# EAGLE design ClockCubed_v1 (EAGLE 6.5.0)
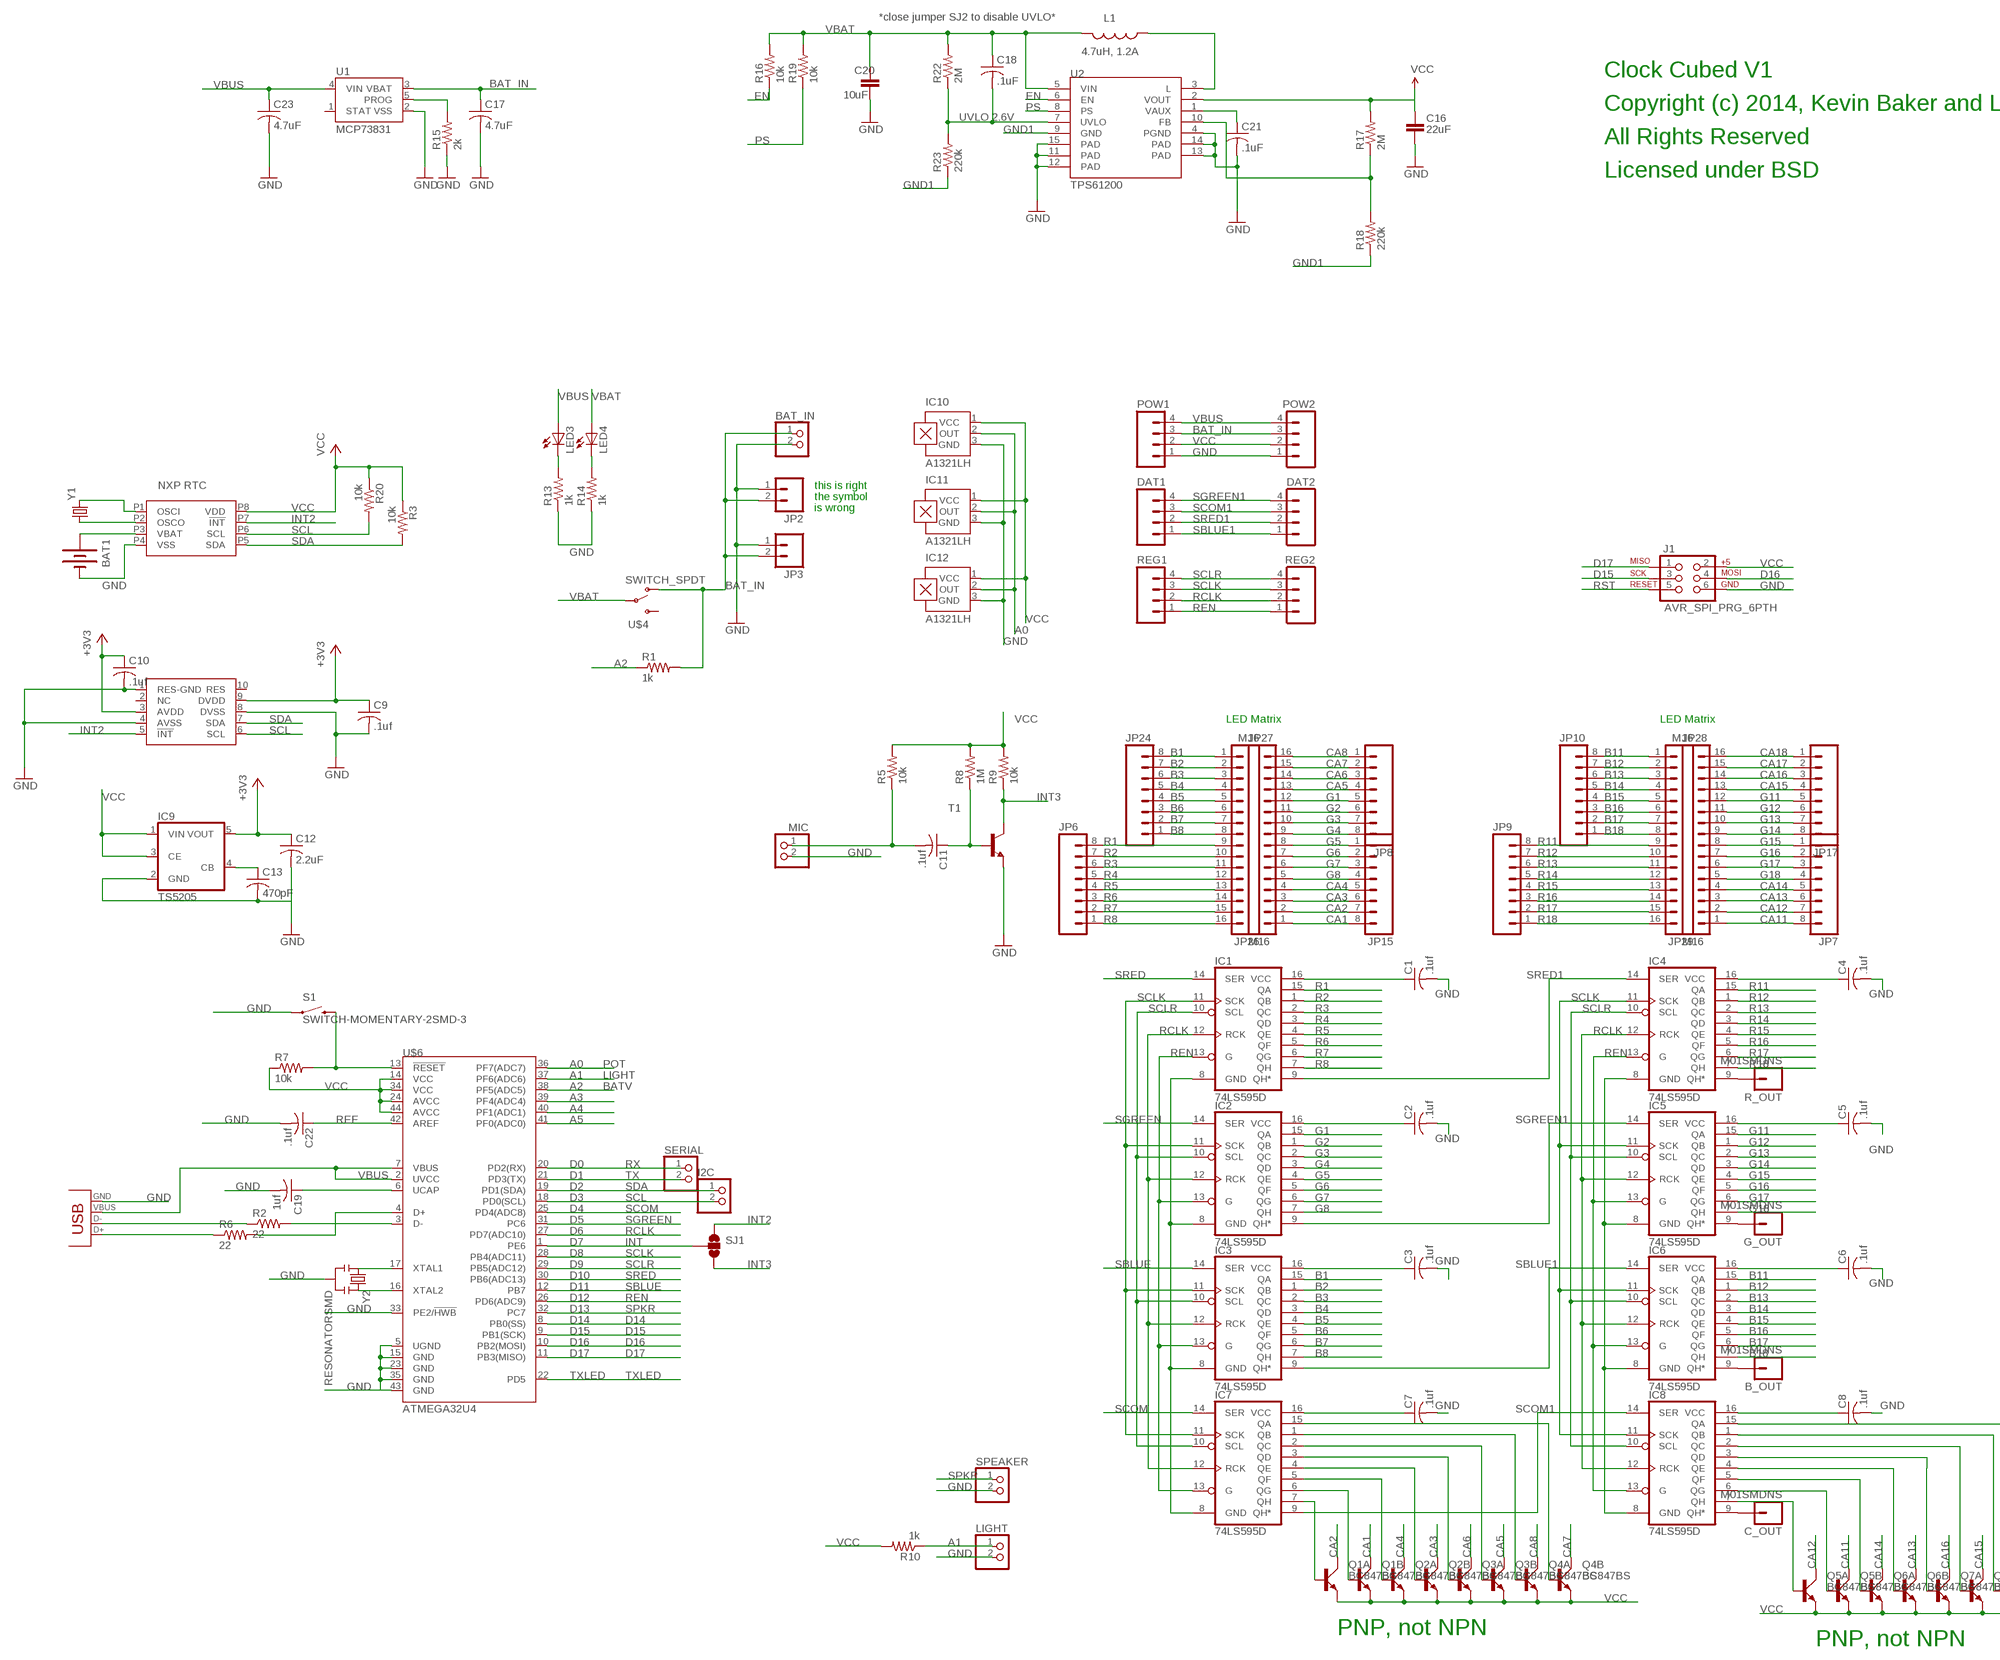
[diagram p0: schematic, sheet 1, part 1 of 2]
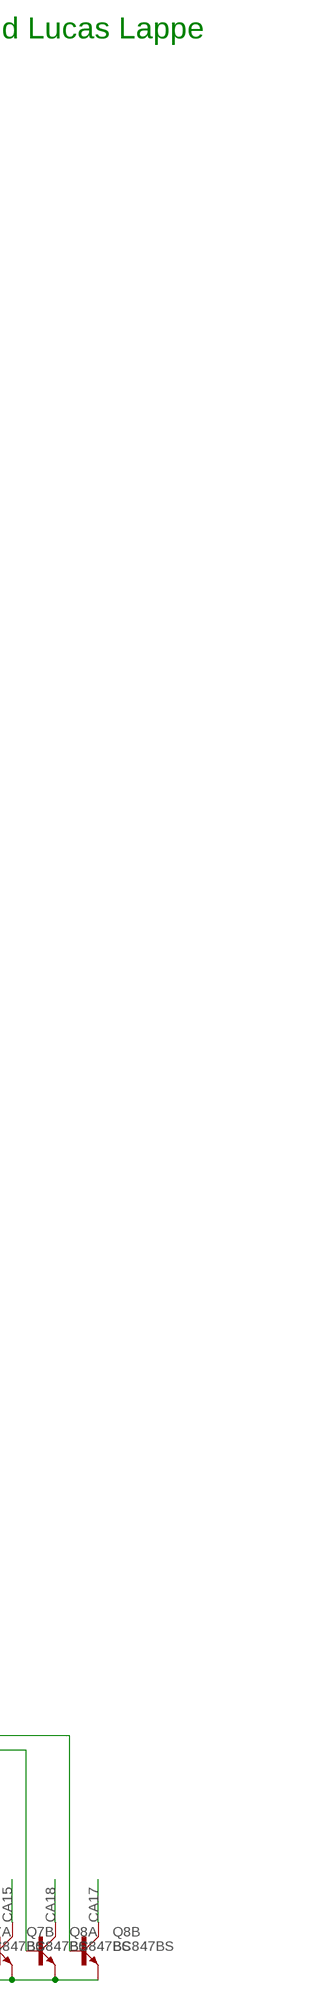
[diagram p1: schematic, sheet 1, part 2 of 2]

## Parts
B_OUT  M01SMDNS  [1X01NS]
BAT1  BATTERY12MM  [BATTCON_12MM]
BAT_IN  PINHD-1X2  [1X02]
C1  .1uf  C-USC0603  [C0603]
C2  .1uf  C-USC0603  [C0603]
C3  .1uf  C-USC0603  [C0603]
C4  .1uf  C-USC0603  [C0603]
C5  .1uf  C-USC0603  [C0603]
C6  .1uf  C-USC0603  [C0603]
C7  .1uf  C-USC0603  [C0603]
C8  .1uf  C-USC0603  [C0603]
C9  .1uf  C-USC0603  [C0603]
C10  .1uf  C-USC0603  [C0603]
C11  .1uf  C-USC0603  [C0603]
C12  2.2uF  C-USC0603  [C0603]
C13  470pF  C-USC0603  [C0603]
C16  22uF  CAP0805  [0805]
C17  4.7uF  C-USC0603  [C0603]
C18  .1uF  C-USC0603  [C0603]
C19  1uf  C-USC0603  [C0603]
C20  10uF  CAP1206  [1206]
C21  .1uF  C-USC0603  [C0603]
C22  .1uf  C-USC0603  [C0603]
C23  4.7uF  C-USC0603  [C0603]
C_OUT  M01SMDNS  [1X01NS]
DAT1  M04PTH  [1X04]
DAT2  M04PTH  [1X04]
G_OUT  M01SMDNS  [1X01NS]
I2C  PINHD-1X2  [1X02]
IC1  74LS595D  [SO16]
IC2  74LS595D  [SO16]
IC3  74LS595D  [SO16]
IC4  74LS595D  [SO16]
IC5  74LS595D  [SO16]
IC6  74LS595D  [SO16]
IC7  74LS595D  [SO16]
IC8  74LS595D  [SO16]
IC9  TS5205  [SOT25]
IC10  A1321LH  [SOT23-W]
IC11  A1321LH  [SOT23-W]
IC12  A1321LH  [SOT23-W]
J1  AVR_SPI_PRG_6PTH  [2X3]
JP2  M02JST-PTH-2  [JST-2-PTH]
JP3  M02JST-PTH-2  [JST-2-PTH]
JP6  M08SMD-COMBO  [1X08_SMD_COMBINED]
JP7  M08SMD-COMBO  [1X08_SMD_COMBINED]
JP8  M08SMD-COMBO  [1X08_SMD_COMBINED]
JP9  M08SMD-COMBO  [1X08_SMD_COMBINED]
JP10  M08SMD-COMBO  [1X08_SMD_COMBINED]
JP15  M08SMD-COMBO  [1X08_SMD_COMBINED]
JP17  M08SMD-COMBO  [1X08_SMD_COMBINED]
JP24  M08SMD-COMBO  [1X08_SMD_COMBINED]
JP26  M16  [1X16_NS]
JP27  M16  [1X16_NS]
JP28  M16  [1X16_NS]
JP29  M16  [1X16_NS]
L1  4.7uH, 1.2A  INDUCTOR.  [CDRH2D09]
LED3  LEDCHIPLED_0805  [CHIPLED_0805]
LED4  LEDCHIPLED_0805  [CHIPLED_0805]
LIGHT  PINHD-1X2  [1X02]
MIC  PINHD-1X2  [1X02]
POW1  M04PTH  [1X04]
POW2  M04PTH  [1X04]
Q1  BC847BS  [SOT363_PHILIPS]
Q2  BC847BS  [SOT363_PHILIPS]
Q3  BC847BS  [SOT363_PHILIPS]
Q4  BC847BS  [SOT363_PHILIPS]
Q5  BC847BS  [SOT363_PHILIPS]
Q6  BC847BS  [SOT363_PHILIPS]
Q7  BC847BS  [SOT363_PHILIPS]
Q8  BC847BS  [SOT363_PHILIPS]
R1  1k  RESISTOR0603-RES  [0603-RES]
R2  22  RESISTOR0603-RES  [0603-RES]
R3  10k  RESISTOR0603-RES  [0603-RES]
R5  10k  RESISTOR0603-RES  [0603-RES]
R6  22  RESISTOR0603-RES  [0603-RES]
R7  10k  RESISTOR0603-RES  [0603-RES]
R8  1M  RESISTOR0603-RES  [0603-RES]
R9  10k  RESISTOR0603-RES  [0603-RES]
R10  1k  RESISTOR0603-RES  [0603-RES]
R13  1k  RESISTOR0603-RES  [0603-RES]
R14  1k  RESISTOR0603-RES  [0603-RES]
R15  2k  RESISTOR0603-RES  [0603-RES]
R16  10k  RESISTOR0603-RES  [0603-RES]
R17  2M  RESISTOR0603-RES  [0603-RES]
R18  220k  RESISTOR0603-RES  [0603-RES]
R19  10k  RESISTOR0603-RES  [0603-RES]
R20  10k  RESISTOR0603-RES  [0603-RES]
R22  2M  RESISTOR0603-RES  [0603-RES]
R23  220k  RESISTOR0603-RES  [0603-RES]
R_OUT  M01SMDNS  [1X01NS]
REG1  M04PTH  [1X04]
REG2  M04PTH  [1X04]
S1  SWITCH-MOMENTARY-2SMD-3  [TACTILE_SWITCH_SMD-3]
SERIAL  PINHD-1X2  [1X02]
SJ1  SOLDERJUMPER_2WAYS  [SJ_3]
SPEAKER  PINHD-1X2  [1X02]
T1  -NPN-SOT23-EBC  [SOT23-EBC]
U1  MCP73831  [SOT23-5]
U2  TPS61200  [QFN-10_PAD]
U$1  USB_MICROB  [USB-MICROB]
U$2  MMA7660FC  [DFN-10]
U$3  NXP-RTC  [HVSON8]
U$4  SWITCH_SPDT  [KPS-1290]
U$6  ATMEGA32U4  [TQFP44]
Y1  CRYSTAL5X2  [CRYSTAL-SMD-5X2]
Y2  RESONATORSMD  [RESONATOR-SMD]

## Nets
+3V3: C9.1 C10.1 C12.1 IC9.5(VOUT) U$2.3(AVDD) U$2.9(DVDD)
A0: IC10.2(OUT) IC11.2(OUT) IC12.2(OUT) U$6.36(PF7(ADC7))
A1: LIGHT.1 R10.1 U$6.37(PF6(ADC6))
A2: R1.1 U$6.38(PF5(ADC5))
A3: U$6.39(PF4(ADC4))
A4: U$6.40(PF1(ADC1))
A5: U$6.41(PF0(ADC0))
B1: IC3.15(QA) JP24.8 JP26.1
B2: IC3.1(QB) JP24.7 JP26.2
B3: IC3.2(QC) JP24.6 JP26.3
B4: IC3.3(QD) JP24.5 JP26.4
B5: IC3.4(QE) JP24.4 JP26.5
B6: IC3.5(QF) JP24.3 JP26.6
B7: IC3.6(QG) JP24.2 JP26.7
B8: IC3.7(QH) JP24.1 JP26.8
B11: IC6.15(QA) JP10.8 JP29.1
B12: IC6.1(QB) JP10.7 JP29.2
B13: IC6.2(QC) JP10.6 JP29.3
B14: IC6.3(QD) JP10.5 JP29.4
B15: IC6.4(QE) JP10.4 JP29.5
B16: IC6.5(QF) JP10.3 JP29.6
B17: IC6.6(QG) JP10.2 JP29.7
B18: IC6.7(QH) JP10.1 JP29.8
BAT_IN: BAT_IN.1 C17.1 JP2.2 JP3.2 POW1.3 POW2.3 R1.2 U1.3(VBAT) U$4.O
CA1: JP15.8 JP27.1 Q1.3(B:C)
CA2: JP15.7 JP27.2 Q1.6(A:C)
CA3: JP15.6 JP27.3 Q2.3(B:C)
CA4: JP15.5 JP27.4 Q2.6(A:C)
CA5: JP8.4 JP27.13 Q3.3(B:C)
CA6: JP8.3 JP27.14 Q3.6(A:C)
CA7: JP8.2 JP27.15 Q4.3(B:C)
CA8: JP8.1 JP27.16 Q4.6(A:C)
CA11: JP7.8 JP28.1 Q5.3(B:C)
CA12: JP7.7 JP28.2 Q5.6(A:C)
CA13: JP7.6 JP28.3 Q6.3(B:C)
CA14: JP7.5 JP28.4 Q6.6(A:C)
CA15: JP17.4 JP28.13 Q7.3(B:C)
CA16: JP17.3 JP28.14 Q7.6(A:C)
CA17: JP17.2 JP28.15 Q8.3(B:C)
CA18: JP17.1 JP28.16 Q8.6(A:C)
D14: U$6.8(PB0(SS))
D15: J1.3 U$6.9(PB1(SCK))
D16: J1.4 U$6.10(PB2(MOSI))
D17: J1.1 U$6.11(PB3(MISO))
D+: R6.1 U$1.P3
D-: R2.1 U$1.P2
EN: R16.1 U2.6(EN)
FB: R17.1 R18.2 U2.10(FB)
G1: IC2.15(QA) JP8.5 JP27.12
G2: IC2.1(QB) JP8.6 JP27.11
G3: IC2.2(QC) JP8.7 JP27.10
G4: IC2.3(QD) JP8.8 JP27.9
G5: IC2.4(QE) JP15.1 JP27.8
G6: IC2.5(QF) JP15.2 JP27.7
G7: IC2.6(QG) JP15.3 JP27.6
G8: IC2.7(QH) JP15.4 JP27.5
G11: IC5.15(QA) JP17.5 JP28.12
G12: IC5.1(QB) JP17.6 JP28.11
G13: IC5.2(QC) JP17.7 JP28.10
G14: IC5.3(QD) JP17.8 JP28.9
G15: IC5.4(QE) JP7.1 JP28.8
G16: IC5.5(QF) JP7.2 JP28.7
G17: IC5.6(QG) JP7.3 JP28.6
G18: IC5.7(QH) JP7.4 JP28.5
GND: BAT1.GND(-) BAT_IN.2 C1.2 C2.2 C3.2 C4.2 C5.2 C6.2 C7.2 C8.2 C9.2 C10.2 C12.2 C13.2 C16.2 C17.2 C19.2 C20.2 C21.2 C22.2 C23.2 IC1.8(GND) IC2.8(GND) IC3.8(GND) IC4.8(GND) IC5.8(GND) IC6.8(GND) IC7.8(GND) IC8.8(GND) IC9.2(GND) IC10.3(GND) IC11.3(GND) IC12.3(GND) J1.6 JP2.1 JP3.1 LIGHT.2 MIC.2 POW1.1 POW2.1 R13.1 R14.1 R15.1 S1.P$1 SPEAKER.2 T1.E U1.2(VSS) U2.4(PGND) U2.11(PAD) U2.12(PAD) U2.13(PAD) U2.14(PAD) U2.15(PAD) U$1.P4 U$1.P5 U$1.P$1 U$1.P$2 U$1.P$3 U$1.P$4 U$1.P$5 U$1.P$6 U$2.1(RES-GND) U$2.4(AVSS) U$2.8(DVSS) U$3.P4(VSS) U$6.5(UGND) U$6.15(GND) U$6.23(GND) U$6.33(PE2/!HWB) U$6.35(GND) U$6.43(GND) Y2.2
GND1: R18.1 R23.1 U2.9(GND)
INT: SJ1.2 U$6.1(PE6)
INT2: SJ1.1 U$2.5(!INT) U$3.P7(!INT)
INT3: R9.1 SJ1.3 T1.C
N$1: IC7.7(QH) Q1.2(A:B)
N$2: IC7.6(QG) Q1.5(B:B)
N$3: U$6.16(XTAL2) Y2.3
N$4: C13.1 IC9.4(CB)
N$5: C11.2 MIC.1 R5.1
N$6: IC8.7(QH) Q5.2(A:B)
N$7: IC7.5(QF) Q2.2(A:B)
N$8: IC7.4(QE) Q2.5(B:B)
N$9: IC7.3(QD) Q3.2(A:B)
N$10: IC8.6(QG) Q5.5(B:B)
N$11: R15.2 U1.5(PROG)
N$12: IC7.2(QC) Q3.5(B:B)
N$13: C11.1 R8.1 T1.B
N$14: IC7.1(QB) Q4.2(A:B)
N$15: C_OUT.1 IC8.9(QH*)
N$16: IC7.15(QA) Q4.5(B:B)
N$17: U$3.P1(OSCI) Y1.2
N$18: U$6.17(XTAL1) Y2.1
N$19: U$3.P2(OSCO) Y1.1
N$20: BAT1.PWR@1(+) U$3.P3(VBAT)
N$21: IC8.5(QF) Q6.2(A:B)
N$22: R6.2 U$6.4(D+)
N$23: R2.2 U$6.3(D-)
N$24: C19.1 U$6.6(UCAP)
N$25: B_OUT.1 IC6.9(QH*)
N$27: IC8.4(QE) Q6.5(B:B)
N$28: IC8.3(QD) Q7.2(A:B)
N$29: IC8.2(QC) Q7.5(B:B)
N$31: IC8.1(QB) Q8.2(A:B)
N$32: IC8.15(QA) Q8.5(B:B)
N$33: LED3.C R13.2
N$34: LED4.C R14.2
N$35: L1.P$1 U2.3(L)
N$36: C21.1 U2.1(VAUX)
N$37: G_OUT.1 IC5.9(QH*)
N$40: IC4.9(QH*) R_OUT.1
PS: R19.1 U2.8(PS)
R1: IC1.15(QA) JP6.8 JP26.9
R2: IC1.1(QB) JP6.7 JP26.10
R3: IC1.2(QC) JP6.6 JP26.11
R4: IC1.3(QD) JP6.5 JP26.12
R5: IC1.4(QE) JP6.4 JP26.13
R6: IC1.5(QF) JP6.3 JP26.14
R7: IC1.6(QG) JP6.2 JP26.15
R8: IC1.7(QH) JP6.1 JP26.16
R11: IC4.15(QA) JP9.8 JP29.9
R12: IC4.1(QB) JP9.7 JP29.10
R13: IC4.2(QC) JP9.6 JP29.11
R14: IC4.3(QD) JP9.5 JP29.12
R15: IC4.4(QE) JP9.4 JP29.13
R16: IC4.5(QF) JP9.3 JP29.14
R17: IC4.6(QG) JP9.2 JP29.15
R18: IC4.7(QH) JP9.1 JP29.16
RCLK: IC1.12(RCK) IC2.12(RCK) IC3.12(RCK) IC4.12(RCK) IC5.12(RCK) IC6.12(RCK) IC7.12(RCK) IC8.12(RCK) REG1.2 REG2.2 U$6.27(PD7(ADC10))
REF: C22.1 U$6.42(AREF)
REN: IC1.13(G) IC2.13(G) IC3.13(G) IC4.13(G) IC5.13(G) IC6.13(G) IC7.13(G) IC8.13(G) REG1.1 REG2.1 U$6.26(PD6(ADC9))
RST: J1.5 R7.2 S1.P$2 U$6.13(!RESET)
RX: SERIAL.1 U$6.20(PD2(RX))
SBLUE: IC3.14(SER) U$6.12(PB7)
SBLUE1: DAT1.1 DAT2.1 IC3.9(QH*) IC6.14(SER)
SCL: I2C.2 R20.2 U$2.6(SCL) U$3.P6(SCL) U$6.18(PD0(SCL))
SCLK: IC1.11(SCK) IC2.11(SCK) IC3.11(SCK) IC4.11(SCK) IC5.11(SCK) IC6.11(SCK) IC7.11(SCK) IC8.11(SCK) REG1.3 REG2.3 U$6.28(PB4(ADC11))
SCLR: IC1.10(SCL) IC2.10(SCL) IC3.10(SCL) IC4.10(SCL) IC5.10(SCL) IC6.10(SCL) IC7.10(SCL) IC8.10(SCL) REG1.4 REG2.4 U$6.29(PB5(ADC12))
SCOM: IC7.14(SER) U$6.25(PD4(ADC8))
SCOM1: DAT1.3 DAT2.3 IC7.9(QH*) IC8.14(SER)
SDA: I2C.1 R3.2 U$2.7(SDA) U$3.P5(SDA) U$6.19(PD1(SDA))
SGREEN: IC2.14(SER) U$6.31(PC6)
SGREEN1: DAT1.4 DAT2.4 IC2.9(QH*) IC5.14(SER)
SPKR: SPEAKER.1 U$6.32(PC7)
SRED: IC1.14(SER) U$6.30(PB6(ADC13))
SRED1: DAT1.2 DAT2.2 IC1.9(QH*) IC4.14(SER)
TX: SERIAL.2 U$6.21(PD3(TX))
TXLED: U$6.22(PD5)
UVLO: C18.2 R22.1 R23.2 U2.7(UVLO)
VBAT: C18.1 C20.1 L1.P$2 LED4.A R16.2 R19.2 R22.2 U2.5(VIN) U$4.P
VBUS: C23.1 LED3.A POW1.4 POW2.4 U1.4(VIN) U$1.P1 U$6.2(UVCC) U$6.7(VBUS)
VCC: C1.1 C2.1 C3.1 C4.1 C5.1 C6.1 C7.1 C8.1 C16.1 IC1.16(VCC) IC2.16(VCC) IC3.16(VCC) IC4.16(VCC) IC5.16(VCC) IC6.16(VCC) IC7.16(VCC) IC8.16(VCC) IC9.1(VIN) IC9.3(CE) IC10.1(VCC) IC11.1(VCC) IC12.1(VCC) J1.2 POW1.2 POW2.2 Q1.1(A:E) Q1.4(B:E) Q2.1(A:E) Q2.4(B:E) Q3.1(A:E) Q3.4(B:E) Q4.1(A:E) Q4.4(B:E) Q5.1(A:E) Q5.4(B:E) Q6.1(A:E) Q6.4(B:E) Q7.1(A:E) Q7.4(B:E) Q8.1(A:E) Q8.4(B:E) R3.1 R5.2 R7.1 R8.2 R9.2 R10.2 R17.2 R20.1 U2.2(VOUT) U$3.P8(VDD) U$6.14(VCC) U$6.24(AVCC) U$6.34(VCC) U$6.44(AVCC)
Unconnected: U1.1(STAT) U$2.2(NC) U$2.10(RES) U$4.S

## Notes on the sheet
- *close jumper SJ2 to disable UVLO*
- Clock Cubed V1
- Copyright (c) 2014, Kevin Baker and Lucas Lappe
- UVLO 2.6V
- All Rights Reserved
- Licensed under BSD
- this is right
- the symbol
- is wrong
- LED Matrix | LED Matrix
- POT
- LIGHT
- BATV
- D0
- D1
- D2
- D3
- D4
- D5
- D6
- D7
- D8
- D9
- D10
- D11
- D12
- D13
- D14
- D15
- D16
- D17
- TXLED
- PNP, not NPN
- PNP, not NPN

## Library data of the parts
B_OUT C_OUT G_OUT R_OUT = SparkFun-Connectors:M01: Header 1 Standard 1-pin 0.1" header. Use with straight break away headers (SKU : PRT-00116), right angle break away headers (PRT-00553), swiss pins (PRT-00743), machine pins (PRT-00117), and female headers (PRT-00115).
BAT1 = SparkFun-Electromechanical:BATTERY: Battery Holders Various common sizes : AA, AAA, 20mm coin cell and 12mm coin cell.
BAT_IN I2C LIGHT MIC SERIAL SPEAKER = pinhead:PINHD-1X2: PIN HEADER
C1-C13 C17-C19 C21-C23 = resistor:C-US: CAPACITOR, American symbol
C16 C20 = CH_passive:CAP: Capacitor Standard 0603 ceramic capacitor, and 0.1" leaded capacitor.
DAT1 DAT2 POW1 POW2 REG1 REG2 = SparkFun-Connectors:M04: Header 4 Standard 4-pin 0.1" header. Use with straight break away headers (SKU : PRT-00116), right angle break away headers (PRT-00553), swiss pins (PRT-00743), machine pins (PRT-00117), and female headers (PRT-00115). Molex polarized connector foot print use with SKU : PRT-08231 with associated crimp pins and housings. 1MM SMD Version SKU: PRT-10208
IC1-IC8 = SparkFun-DigitalIC:74*595: 8-bit SHIFT REGISTER, output latch
IC9 = v-reg:TS5205: 150mA Low Noise LDO Voltage Regulator with Enable TSC [Taiwan Semiconductor Company, Ltd] Source: http://www.taiwansemi.com .. 5205_0409c.pdf
IC10-IC12 = allegro:A13*?: Linear Hall Effect Sensor ICs Continuous-Time Ratiometric High-Temperature Operation Programmable Linear with Analog Output A1302 -Replacement- UGN3503 Source: http://www.allegromicro.com/en/Products/Part_Numbers/1301/1301.pdf http://www.allegromicro.com/en/Products/Part_Numbers/1321/1321.pdf http://www.allegromicro.com/en/Products/Part_Numbers/1381/1381.pdf; MF: ALLEGRO MICROSYSTEMS, INC.; MPN: A1321LLHLT-T; OC_FARNELL: 1457116; OC_NEWARK: 65K5146
J1 = SparkFun-Connectors:AVR_SPI_PRG_6: AVR ISP 6 Pin This is the reduced ISP connector for AVR programming. Common on Arduino. This footprint will take up less PCB space and can be used with a 10-pin to 6-pin adapter such as SKU: BOB-08508
JP2 JP3 = SparkFun-Connectors:M02: Header 2 Standard 2-pin 0.1" header. Use with straight break away headers (SKU : PRT-00116), right angle break away headers (PRT-00553), swiss pins (PRT-00743), machine pins (PRT-00117), and female headers (PRT-00115). Molex polarized connector foot print use with SKU : PRT-08233 with associated crimp pins and housings.
JP6-JP10 JP15 JP17 JP24 = SparkFun-Connectors:M08: Header 8 Standard 8-pin 0.1" header. Use with straight break away headers (SKU : PRT-00116), right angle break away headers (PRT-00553), swiss pins (PRT-00743), machine pins (PRT-00117), and female headers (PRT-00115).
JP26-JP29 = SparkFun-Connectors:M16: 1x16 .1" header
L1 = SparkFun:INDUCTOR: Inductors Basic Inductor/Choke - 0603 and 1206. Footprints are not proven and vary greatly between part numbers.
LED3 LED4 = led:LED: LED OSRAM: - CHIPLED LG R971, LG N971, LY N971, LG Q971, LY Q971, LO R971, LY R971 LH N974, LH R974 LS Q976, LO Q976, LY Q976 LO Q996 - Hyper CHIPLED LW Q18S LB Q993, LB Q99A, LB R99A - SideLED LS A670, LO A670, LY A670, LG A670, LP A670 LB A673, LV A673, LT A673, LW A673 LH A674 LY A675 LS A676, LA A676, LO A676, LY A676, LW A676 LS A679, LY A679, LG A679 - Hyper Micro SIDELED® LS Y876, LA Y876, LO Y876, LY Y876 LT Y87S - SmartLED LW L88C, LW L88S LB L89C, LB L89S, LG L890 LS L89K, LO L89K, LY L89K LS L896, LA L896, LO L896, LY L896 - TOPLED LS T670, LO T670, LY T670, LG T670, LP T670 LSG T670, LSP T670, LSY T670, LOP T670, LYG T670 LG T671, LOG T671, LSG T671 LB T673, LV T673, LT T673, LW T673 LH T674 LS T676, LA T676, LO T676, LY T676, LB T676, LH T676, LSB T676, LW T676 LB T67C, LV T67C, LT T67C, LS T67K, LO T67K, LY T67K, LW E67C LS E67B, LA E67B, LO E67B, LY E67B, LB E67C, LV E67C, LT E67C LW T67C LS T679, LY T679, LG T679 LS T770, LO T770, LY T770, LG T770, LP T770 LB T773, LV T773, LT T773, LW T773 LH T774 LS E675, LA E675, LY E675, LS T675 LS T776, LA T776, LO T776, LY T776, LB T776 LHGB T686 LT T68C, LB T68C - Hyper Mini TOPLED® LB M676 - Mini TOPLED Santana® LG M470 LS M47K, LO M47K, LY M47K Source: http://www.osram.convergy.de LUXEON: - LUMILED® LXK2-PW12-R00, LXK2-PW12-S00, LXK2-PW14-U00, LXK2-PW14-V00 LXK2-PM12-R00, LXK2-PM12-S00, LXK2-PM14-U00 LXK2-PE12-Q00, LXK2-PE12-R00, LXK2-PE12-S00, LXK2-PE14-T00, LXK2-PE14-U00 LXK2-PB12-K00, LXK2-PB12-L00, LXK2-PB12-M00, LXK2-PB14-N00, LXK2-PB14-P00, LXK2-PB14-Q00 LXK2-PR12-L00, LXK2-PR12-M00, LXK2-PR14-Q00, LXK2-PR14-R00 LXK2-PD12-Q00, LXK2-PD12-R00, LXK2-PD12-S00 LXK2-PH12-R00, LXK2-PH12-S00 LXK2-PL12-P00, LXK2-PL12-Q00, LXK2-PL12-R00 Source: www.luxeon.com KINGBRIGHT: KA-3528ASYC Source: www.kingbright.com
Q1-Q8 = transistor-small-signal:BC847BS: NPN general purpose double transistor Source: http://www.farnell.com/datasheets/2466.pdf
R1-R3 R5-R10 R13-R20 R22 R23 = SparkFun:RESISTOR: Resistor Basic schematic elements and footprints for 0603, 1206, and PTH resistors.
S1 = SparkFun:SWITCH-MOMENTARY-2
SJ1 = SparkFun-Passives:SOLDERJUMPER_2WAY: Solder Jumper 2 way solder jumper
T1 = transistor:*-NPN-: NPN Transistror BF959 corrected 2008.03.06
U1 = SparkFun:MCP73831: Microchip's MCP73831 Miniature single cell, fully integrated Li-Ion, Li-polymer charge management controller http://ww1.microchip.com/downloads/en/DeviceDoc/21984a.pdf
U2 = SparkFun:TPS61200: DC to DC Booster
U$1 = bakerk6:USB_MICROB
U$2 = freescale:MMA7660FC
U$3 = bakerk6:NXP-RTC
U$4 = SparkFun-Electromechanical:SWITCH_SPDT: Side-actuated SPDT slide switch, as used on the Arduino Pro
U$6 = SparkFun-DigitalIC:ATMEGA32U4: Atmel 44-pin 8-bit Microcontroller with 32KBytes of ISP Flash and USB Controller
Y1 = SparkFun-FreqCtrl:CRYSTAL: Various standard crystals. Proven footprints. Spark Fun Electronics SKU : COM-00534
Y2 = SparkFun:RESONATOR: Resonator Small SMD resonator. This is the itty bitty 10/20MHz resonators with built in caps. CSTCE10M0G55 and CSTCE20M0V53. Footprint has been reviewed closely but hasn't been tested yet.

## Board
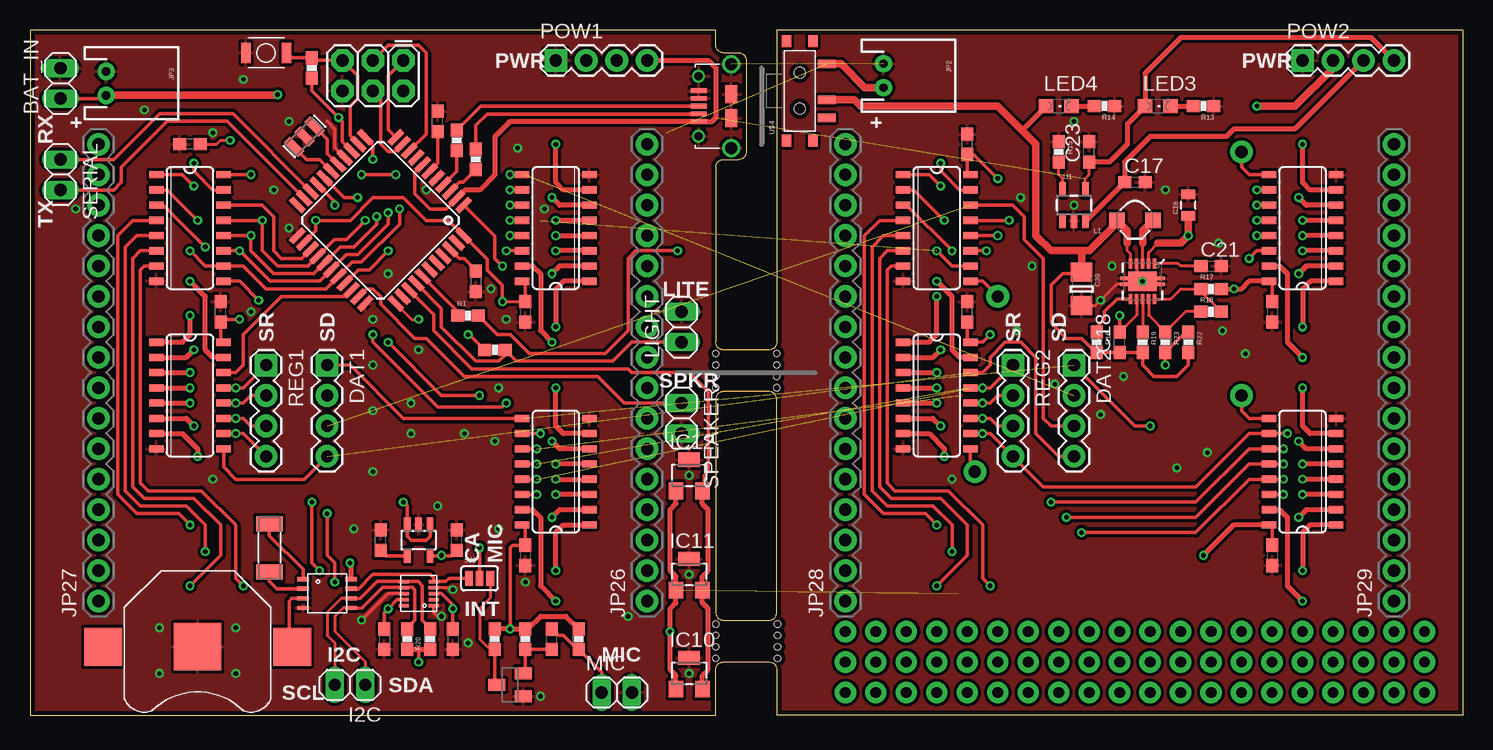
[diagram p2: board, top side]
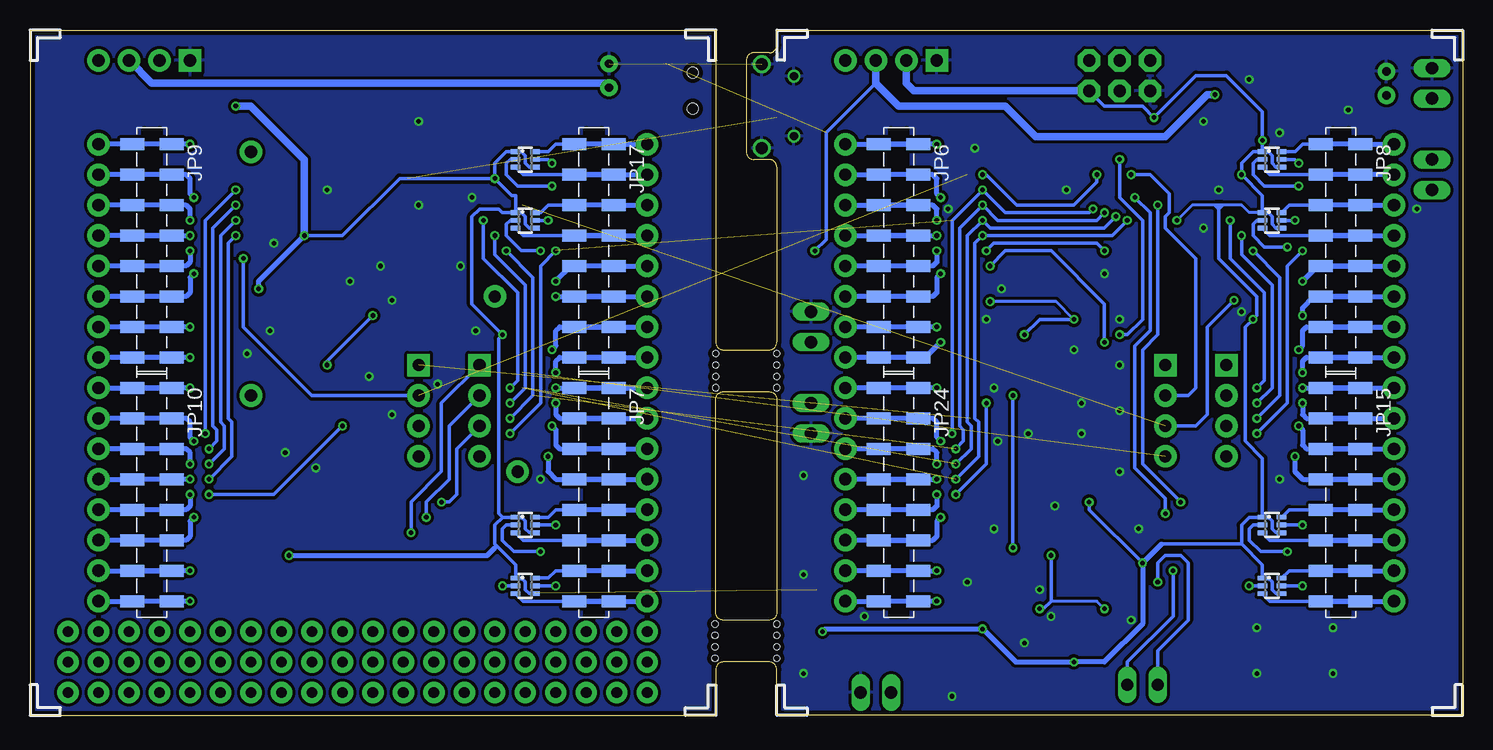
[diagram p3: board, bottom side, seen from below]

Size 119.38 x 57.15 mm. Coordinates in mm from the lower left corner, seen from the top.
Outline: 0,0 57.15,0 57.15,3.81 arc-90 57.78,4.45 61.59,4.45 arc-90 62.23,3.81 62.23,0 119.38,0 119.38,57.15 62.23,57.15 62.23,31.11 arc-90 61.59,30.48 57.78,30.48 arc-90 57.15,31.11 57.15,45.72 arc-90 57.78,46.35 59.05,46.35 arc90 59.69,46.99 59.69,54.61 arc90 59.05,55.24 57.78,55.24 arc-90 57.15,55.88 57.15,57.15 0,57.15 0,0
Outline: 62.23,8.57 62.23,26.35 arc90 61.59,26.99 57.78,26.99 arc90 57.15,26.35 57.15,8.57 arc90 57.78,7.94 61.59,7.94 arc90 62.23,8.57
Copper layers (1*16): Top 0.0356mm / dielectric 1.5011mm / Bottom 0.0356mm
Design rules: minimum track width 6mil, minimum drill 13mil, track to track 6mil, track to pad 6mil, pad to pad 6mil, via to via 6mil, smd to smd 6mil, copper to edge 15mil, drill to drill 6mil, minimum pad ring 7mil, minimum via ring 7mil, stop-mask expansion 4mil, vias tented up to drill 16mil, thermal gap 10mil
Holes 0.51 mm at 62.29,7.62 57.15,30.16 57.15,29.21 57.15,28.26 62.23,28.26 62.23,29.21 62.23,30.16 62.29,6.67 62.29,5.71 62.29,4.76 57.15,7.62 57.15,6.67 57.15,5.71 57.15,4.76 62.23,27.3 57.15,27.3
tRestrict: area 57.2,0 to 59.7,35.6; area 59.7,0 to 62.2,57.1
bRestrict: area 59.7,0 to 62.2,57.1; area 57.2,0 to 59.7,35.6; area 9.5,8.3 to 10.8,48.9; area 46.4,8.3 to 47.6,48.9; area 71.8,8.3 to 73,48.9; area 108.6,8.3 to 109.9,48.9

### Footprints (pad centres in the part's own frame; a part is rotated, then mirrored left to right if it is on the bottom)
1X01NS = drill 1.016 pad 1.88: 1 0,0
BATTCON_12MM = smd 3.962 x 3.962: GND 0,0 | smd 3.175 x 3.175: PWR@1 -7.874,0; PWR@2 7.874,0
1X02 = drill 1.016 long: 1 -1.27,0; 2 1.27,0
C0603 = smd 1.1 x 1: 1 -0.85,0; 2 0.85,0
0805 = smd 0.8 x 1.2: 1 -0.9,0; 2 0.9,0
1206 = smd 1.6 x 1.8: 1 -1.4,0; 2 1.4,0
1X04 = drill 1.016 pad 1.88 square: 1 0,0 | drill 1.016 pad 1.88: 2 2.54,0; 3 5.08,0; 4 7.62,0
SO16 = smd 0.6 x 1.2: 1 -4.445,-2.8; 2 -3.175,-2.8; 3 -1.905,-2.8; 4 -0.635,-2.8; 5 0.635,-2.8; 6 1.905,-2.8; 7 3.175,-2.8; 8 4.445,-2.8; 9 4.445,2.8; 10 3.175,2.8; 11 1.905,2.8; 12 0.635,2.8; 13 -0.635,2.8; 14 -1.905,2.8; 15 -3.175,2.8; 16 -4.445,2.8
SOT25 = smd 0.55 x 1.2: 1 -0.95,-1.3; 2 0,-1.3; 3 0.95,-1.3; 4 0.95,1.3; 5 -0.95,1.3
SOT23-W = smd 1.2 x 1.4: 1 -1.1,-1.3; 2 1.1,-1.3 | smd 1.8 x 1.2: 3 0,1.3
2X3 = drill 1.016 pad 1.88 octagon: 1 0,0; 2 0,2.54; 3 2.54,0; 4 2.54,2.54; 5 5.08,0; 6 5.08,2.54
JST-2-PTH = drill 0.7 pad 1.448: 1 -1,0; 2 1,0
1X08_SMD_COMBINED = smd 1 x 2: 1 0,1.65; 1@2 0,-1.65; 2 2.54,-1.65; 2@2 2.54,1.65; 3 5.08,1.65; 3@2 5.08,-1.65; 4 7.62,-1.65; 4@2 7.62,1.65; 5 10.16,1.65; 5@2 10.16,-1.65; 6 12.7,-1.65; 6@2 12.7,1.65; 7 15.24,1.65; 7@2 15.24,-1.65; 8 17.78,-1.65; 8@2 17.78,1.65
1X16_NS = drill 1.016 pad 1.88: 1 0,0; 2 2.54,0; 3 5.08,0; 4 7.62,0; 5 10.16,0; 6 12.7,0; 7 15.24,0; 8 17.78,0; 9 20.32,0; 10 22.86,0; 11 25.4,0; 12 27.94,0; 13 30.48,0; 14 33.02,0; 15 35.56,0; 16 38.1,0
CDRH2D09 = smd 1.3 x 1.3: P$1 -1.5,0; P$2 1.5,0
CHIPLED_0805 = smd 1.2 x 1.2: A 0,-1.05; C 0,1.05
SOT363_PHILIPS = smd 0.4 x 0.8: 1 -0.65,-0.8; 2 0,-0.8; 3 0.65,-0.8; 4 0.65,0.8; 5 0,0.8; 6 -0.65,0.8
0603-RES = smd 1.1 x 1: 1 -0.85,0; 2 0.85,0
TACTILE_SWITCH_SMD-3 = smd 0.8 x 1.7: P$1 -1.7,0; P$2 1.7,0
SJ_3 = smd 0.635 x 1.27: 1 -0.889,0; 2 0,0; 3 0.889,0
SOT23-EBC = smd 1 x 1.4: B 0.95,-1.1; C 0,1.1; E -0.95,-1.1
SOT23-5 = smd 0.55 x 1.2: 1 -0.95,-1.3; 2 0,-1.3; 3 0.95,-1.3; 4 0.95,1.3; 5 -0.95,1.3
QFN-10_PAD = smd 0.297 x 0.85: 1 -1,-1.475; 2 -0.5,-1.475; 3 0,-1.475; 4 0.5,-1.475; 5 1,-1.475; 6 1,1.475; 7 0.5,1.475; 8 0,1.475; 9 -0.5,1.475; 10 -1,1.475 | smd 0.7 x 0.28: 11 -1.5,0.25; 12 -1.5,-0.25; 13 1.5,0.25; 14 1.5,-0.25 | smd 2.4 x 1.65: 15 0,0
USB-MICROB = smd 0.4 x 1.35: P1 -1.3,2.7; P2 -0.65,2.7; P3 0,2.7; P4 0.65,2.7; P5 1.3,2.7 | drill 1: P$1 -3.5,0; P$2 3.5,0 | drill 0.7: P$3 -2.5,2.7; P$4 2.5,2.7 | smd 1.5 x 1: P$5 -1,0; P$6 1,0
DFN-10 = smd 0.3 x 0.825: 1 -1,-1.25; 2 -0.5,-1.25; 3 0,-1.25; 4 0.5,-1.25; 5 1,-1.25; 6 1,1.25; 7 0.5,1.25; 8 0,1.25; 9 -0.5,1.25; 10 -1,1.25
HVSON8 = smd 0.35 x 0.95: P1 -1.2,-2; P2 -0.4,-2; P3 0.4,-2; P4 1.2,-2; P5 1.2,2; P6 0.4,2; P7 -0.4,2; P8 -1.2,2
KPS-1290 = smd 0.7 x 1.5: O -2.25,2.25; P 0.75,2.25; S 2.25,2.25 | smd 1 x 0.8: P$1 -4.15,1.1; P$2 -4.15,-1.1; P$3 4.15,-1.1; P$4 4.15,1.1 | hole 0.9: -1.5,0; 1.5,0
TQFP44 = smd 1.5 x 0.5: 1 -5.8,4; 2 -5.8,3.2; 3 -5.8,2.4; 4 -5.8,1.6; 5 -5.8,0.8; 6 -5.8,0; 7 -5.8,-0.8; 8 -5.8,-1.6; 9 -5.8,-2.4; 10 -5.8,-3.2; 11 -5.8,-4; 23 5.8,-4; 24 5.8,-3.2; 25 5.8,-2.4; 26 5.8,-1.6; 27 5.8,-0.8; 28 5.8,0; 29 5.8,0.8; 30 5.8,1.6; 31 5.8,2.4; 32 5.8,3.2; 33 5.8,4 | smd 0.5 x 1.5: 12 -4,-5.8; 13 -3.2,-5.8; 14 -2.4,-5.8; 15 -1.6,-5.8; 16 -0.8,-5.8; 17 0,-5.8; 18 0.8,-5.8; 19 1.6,-5.8; 20 2.4,-5.8; 21 3.2,-5.8; 22 4,-5.8; 34 4,5.8; 35 3.2,5.8; 36 2.4,5.8; 37 1.6,5.8; 38 0.8,5.8; 39 0,5.8; 40 -0.8,5.8; 41 -1.6,5.8; 42 -2.4,5.8; 43 -3.2,5.8; 44 -4,5.8
CRYSTAL-SMD-5X2 = smd 1.27 x 2.21: 1 -2,0; 2 2,0
RESONATOR-SMD = smd 0.7 x 1.7: 1 -1.2,0; 2 0,0; 3 1.2,0

### Placement (x,y rotation side)
B_OUT  100.97,26.67 0 top
BAT1  13.97,5.71 180 top
BAT_IN  2.54,52.7 90 top
C1  41.27,33.66 270 top
C2  41.27,13.34 270 top
C3  15.88,33.66 90 top
C4  103.5,13.34 270 top
C5  103.5,33.66 270 top
C6  78.11,33.66 90 top
C7  78.11,47.62 90 top
C8  13.34,47.62 180 top
C9  35.24,6.35 270 top
C10  29.53,6.35 270 top
C11  43.5,6.35 90 top
C12  35.56,14.61 90 top
C13  29.21,14.61 90 top
C16  96.52,42.55 90 top
C17  92.08,44.45 0 top
C18  90.81,31.11 90 top
C19  33.97,49.53 90 top
C20  87.63,35.56 270 top
C21  98.42,37.47 0 top
C22  37.15,36.2 270 top
C23  88.27,46.99 90 top
C_OUT  80.64,34.92 0 top
DAT1  24.77,29.21 270 top
DAT2  87,29.21 270 top
G_OUT  78.74,20.32 0 top
I2C  26.67,2.54 180 top
IC1  43.81,40.64 90 top
IC2  13.34,26.67 270 top
IC3  43.81,20.32 90 top
IC4  106.05,40.64 90 top
IC5  75.56,26.67 270 top
IC6  106.05,20.32 90 top
IC7  13.34,40.64 270 top
IC8  75.56,40.64 270 top
IC9  32.38,14.61 180 top
IC10  54.93,3.49 0 top
IC11  54.93,11.75 0 top
IC12  54.93,20 0 top
J1  31.11,54.61 180 top
JP2  71.12,53.34 270 top
JP3  6.35,52.7 270 top
JP6  46.99,47.62 270 bottom
JP7  72.39,27.3 270 bottom
JP8  10.16,47.62 270 bottom
JP9  109.22,47.62 270 bottom
JP10  109.22,27.3 270 bottom
JP15  10.16,27.3 270 bottom
JP17  72.39,47.62 270 bottom
JP24  46.99,27.3 270 bottom
JP26  51.44,9.53 90 top
JP27  5.71,9.53 90 top
JP28  67.94,9.53 90 top
JP29  113.67,9.53 90 top
L1  92.08,41.27 180 top
LED3  93.98,50.8 270 top
LED4  85.72,50.8 270 top
LIGHT  54.29,32.38 90 top
MIC  48.9,1.91 0 top
POW1  43.81,54.61 0 top
POW2  106.05,54.61 0 top
Q1  15.88,10.79 270 bottom
Q2  15.88,15.88 270 bottom
Q3  15.88,41.27 270 bottom
Q4  15.88,46.35 270 bottom
Q5  78.11,10.79 270 bottom
Q6  78.11,15.88 270 bottom
Q7  78.11,41.27 270 bottom
Q8  78.11,46.35 270 bottom
R1  36.51,33.34 0 top
R2  37.15,46.35 270 top
R3  31.43,6.35 90 top
R5  45.72,6.35 90 top
R6  35.56,47.94 270 top
R7  23.5,53.98 90 top
R8  41.27,6.35 90 top
R9  38.73,6.35 90 top
R10  38.73,30.48 180 top
R13  97.79,50.8 180 top
R14  89.53,50.8 180 top
R15  85.72,46.99 270 top
R16  88.9,31.11 270 top
R17  98.42,35.56 0 top
R18  98.42,33.66 0 top
R19  92.71,31.11 270 top
R20  33.34,6.35 90 top
R22  96.52,31.11 270 top
R23  94.61,31.11 270 top
R_OUT  100.97,46.99 0 top
REG1  19.68,29.21 270 top
REG2  81.92,29.21 270 top
S1  19.68,55.24 0 top
SERIAL  2.54,45.09 270 top
SJ1  37.47,11.43 0 top
SPEAKER  54.29,24.77 270 top
T1  40.01,2.54 90 top
U1  87,42.55 0 top
U2  92.71,36.2 180 top
U$1  58.42,50.8 90 top
U$2  32.38,10.16 90 top
U$3  24.77,10.16 270 top
U$4  64.14,52.07 270 top
U$6  29.21,41.27 225 top
Y1  19.95,13.97 90 top
Y2  22.86,48.26 45 top

### Tracks (layer width: path | path; a pad name or v marks a point on that pad's centre or on a via)
+3V3  (via drill 0.38)
  Top 0.305: C12.1 35.11,13.3 IC9.5 34.26,13.3 v34.29,13.34 | U$2.9 30.61,9.66 v29.84,8.89 29.53,8.57 C10.1 | U$2.3 34.29,10.16 35.24,9.21 v35.24,8.89 C9.1
  Bottom 0.254: v29.84,8.89 30.48,9.53 34.29,9.53
  Bottom 0.305: v34.29,13.34 34.29,9.53 34.92,8.89 v35.24,8.89
A0
  Top 0.305: U$6.36 33.66,33.44 33.66,32.07 36.83,28.89 49.85,28.89 50.16,28.57 54.93,28.57 56.52,26.99 56.52,20.32 56.2,20 56.2,18.87 IC12.2
  Top 0.406: IC10.2 56.03,3.32 56.52,3.81 56.52,8.89 56.03,9.38 IC11.2 56.03,11.58 56.52,12.06 56.52,17.14 56.03,17.63 IC12.2
A1
  Top 0.305: LIGHT.1 50.16,31.11 48.58,29.53 40.54,29.53 R10.1 39.59,30.06 39.05,29.53 37.15,29.53 34.29,32.38 34.29,33.93 U$6.37
A2
  Top 0.305: U$6.38 35.66,33.69 R1.1
B1  (via drill 0.38)
  Top 0.406: IC3.15 41.91,17.14 42.55,16.51 42.55,10.79 v43.81,9.53
  Bottom 0.406: JP26.1 JP24.8 v43.81,9.53
B2  (via drill 0.38)
  Top 0.406: v43.81,12.06 43.81,15.24 44.45,15.88 IC3.1
  Bottom 0.406: JP26.2 JP24.7 v43.81,12.06
B3  (via drill 0.38)
  Top 0.406: IC3.2 44.13,17.14 v43.5,16.51
  Bottom 0.406: JP26.3 JP24.6 44.13,14.61 43.81,14.92 43.81,16.19 v43.5,16.51
B4  (via drill 0.38)
  Top 0.406: IC3.3 v43.81,18.41
  Bottom 0.406: JP26.4 JP24.5 44.13,17.14 43.81,17.46 v43.81,18.41
B5  (via drill 0.38)
  Top 0.406: v43.81,19.68 IC3.4
  Bottom 0.406: JP26.5 JP24.4 v43.81,19.68
B6  (via drill 0.38)
  Top 0.406: IC3.5 v43.81,20.95
  Bottom 0.406: JP26.6 JP24.3 44.13,22.23 43.81,21.91 v43.81,20.95
B7  (via drill 0.38)
  Top 0.406: IC3.6 44.13,22.23 v43.5,22.86
  Bottom 0.406: JP26.7 JP24.2 44.13,24.77 43.81,24.45 43.81,23.18 v43.5,22.86
B8  (via drill 0.38)
  Top 0.406: IC3.7 44.45,23.5 43.81,24.13 v43.81,27.3
  Bottom 0.406: JP26.8 JP24.1 v43.81,27.3
B11  (via drill 0.38)
  Top 0.406: IC6.15 104.14,17.14 104.78,16.51 104.78,10.79 v106.05,9.53
  Bottom 0.406: JP29.1 JP10.8 v106.05,9.53
B12  (via drill 0.38)
  Top 0.406: IC6.1 106.68,15.88 106.05,15.24 v106.05,12.06
  Bottom 0.406: JP29.2 JP10.7 v106.05,12.06
B13  (via drill 0.38)
  Top 0.406: IC6.2 106.36,17.14 v105.73,16.51
  Bottom 0.406: JP29.3 JP10.6 106.36,14.61 106.05,14.92 106.05,16.19 v105.73,16.51
B14  (via drill 0.38)
  Top 0.406: IC6.3 v106.05,18.41
  Bottom 0.406: JP29.4 JP10.5 106.36,17.14 106.05,17.46 v106.05,18.41
B15  (via drill 0.38)
  Top 0.406: IC6.4 v106.05,19.68
  Bottom 0.406: JP29.5 JP10.4 v106.05,19.68
B16  (via drill 0.38)
  Top 0.406: IC6.5 v106.05,20.95
  Bottom 0.406: JP29.6 JP10.3 106.36,22.23 106.05,21.91 v106.05,20.95
B17  (via drill 0.38)
  Top 0.406: IC6.6 106.36,22.23 v105.73,22.86
  Bottom 0.406: JP29.7 JP10.2 106.36,24.77 106.05,24.45 106.05,23.18 v105.73,22.86
B18  (via drill 0.38)
  Top 0.406: IC6.7 106.68,23.5 106.05,24.13 v106.05,27.3
  Bottom 0.406: JP29.8 JP10.1 v106.05,27.3
BAT_IN  (via drill 0.38)  (1 unrouted)
  Top 0.305: JP3.2 6.08,51.44 BAT_IN.1 | R1.2 38.95,31.75 40.01,31.75 41.59,30.16 47.94,30.16 49.85,32.07 49.85,38.1 50.48,38.73 v53.98,38.73
  Top 0.406: U1.3 88.02,41.24 C17.1 91.22,46.14 93.34,48.26 99.69,48.26 100.33,48.9 105.41,48.9 POW2.3
  Top 0.61: JP3.2 20.59,51.7 v20.64,51.75 | JP2.2 69.58,52.34 67.6,54.32 U$4.O
  Bottom 0.305: v53.98,38.73 53.02,39.69 53.02,48.58 49.05,52.55 48.74,52.55
  Bottom 0.61: v20.64,51.75 21.27,51.75 24.77,48.26 35.56,48.26 38.1,50.8 46.99,50.8 48.74,52.55 48.9,52.7 POW1.3 | JP2.2 71.48,52.7 109.22,52.7 POW2.3
CA1
  Bottom 0.305: Q1.3 16.05,9.53 JP15.8
  Bottom 0.406: JP15.8 JP27.1
CA2
  Bottom 0.305: Q1.6 14.46,12.06 JP15.7
  Bottom 0.406: JP15.7 JP27.2
CA3
  Bottom 0.305: Q2.3 16.05,14.61 JP15.6
  Bottom 0.406: JP15.6 JP27.3
CA4
  Bottom 0.305: Q2.6 14.46,17.14 JP15.5
  Bottom 0.406: JP15.5 JP27.4
CA5
  Bottom 0.305: Q3.3 16.05,40.01 JP8.4
  Bottom 0.406: JP8.4 JP27.13
CA6
  Bottom 0.305: Q3.6 14.46,42.55 JP8.3
  Bottom 0.406: JP8.3 JP27.14
CA7
  Bottom 0.305: Q4.3 16.05,45.09 JP8.2
  Bottom 0.406: JP27.15 JP8.2
CA8
  Bottom 0.305: Q4.6 13.96,47.01 13.34,47.62 JP8.1
  Bottom 0.406: JP8.1 JP27.16
CA11
  Bottom 0.305: JP7.8 78.28,9.53 Q5.3
  Bottom 0.406: JP7.8 JP28.1
CA12
  Bottom 0.305: Q5.6 76.19,11.45 75.56,12.06 JP7.7
  Bottom 0.406: JP7.7 JP28.2
CA13
  Bottom 0.305: JP7.6 78.28,14.61 Q6.3
  Bottom 0.406: JP7.6 JP28.3
CA14
  Bottom 0.305: Q6.6 76.19,16.52 75.56,17.14 JP7.5
  Bottom 0.406: JP7.5 JP28.4
CA15
  Bottom 0.305: JP17.4 78.28,40.01 Q7.3
  Bottom 0.406: JP17.4 JP28.13
CA16
  Bottom 0.305: JP17.3 76.2,42.55 76.83,41.91 76.85,41.92 Q7.6
  Bottom 0.406: JP17.3 JP28.14
CA17
  Bottom 0.305: JP17.2 78.28,45.09 Q8.3
  Bottom 0.406: JP17.2 JP28.15
CA18
  Bottom 0.305: Q8.6 76.19,47.01 75.56,47.62 JP17.1
  Bottom 0.406: JP17.1 JP28.16
D15
  Top 0.305: J1.3 29.84,55.88 32.38,55.88 33.02,55.24 33.02,48.48 U$6.9
D16
  Top 0.305: J1.4 29.21,51.44 29.21,47.62 29.84,46.99 30.4,46.99 U$6.10
D17
  Top 0.305: J1.1 29.84,53.34 29.84,48.84 U$6.11
D+
  Top 0.305: U$1.P3 37.57,50.8 R6.1
D-
  Top 0.305: U$1.P2 38.09,50.15 37.15,49.21 R2.1
EN
  Top 0.305: U2.6 90.6,34.72 89.53,33.66 89.53,33.02 88.9,32.38 R16.1
FB
  Top 0.254: R18.2 97.58,35.35 R17.1 95.89,35.56 95.05,34.72 U2.10
G1  (via drill 0.38)
  Top 0.406: IC2.15 15.24,29.84 14.61,30.48 14.61,34.92 v13.34,36.2
  Bottom 0.406: JP27.12 JP8.5 12.06,37.47 v13.34,36.2
G2  (via drill 0.38)
  Top 0.406: IC2.1 12.7,31.11 13.34,31.75 v13.34,33.34
  Bottom 0.406: JP27.11 JP8.6 12.38,34.92 13.34,33.97 v13.34,33.34
G3  (via drill 0.38)
  Top 0.406: IC2.2 13.02,29.84 v13.65,30.48
  Bottom 0.406: JP27.10 JP8.7 13.02,32.38 13.34,32.07 13.34,30.8 v13.65,30.48
G4  (via drill 0.38)
  Top 0.406: IC2.3 v13.34,28.57
  Bottom 0.406: JP27.9 JP8.8 13.02,29.84 13.34,29.53 v13.34,28.57
G5  (via drill 0.38)
  Top 0.406: IC2.4 v13.34,27.3
  Bottom 0.406: JP27.8 JP15.1 v13.34,27.3
G6  (via drill 0.38)
  Top 0.406: IC2.5 v13.34,26.04
  Bottom 0.406: JP27.7 JP15.2 13.02,24.77 13.34,25.08 v13.34,26.04
G7  (via drill 0.38)
  Top 0.406: IC2.6 13.02,24.77 v13.65,24.13
  Bottom 0.406: JP27.6 JP15.3 13.02,22.23 13.34,22.54 13.34,23.81 v13.65,24.13
G8  (via drill 0.38)
  Top 0.406: IC2.7 12.7,23.5 13.97,22.23 v13.97,21.59
  Bottom 0.406: JP27.5 JP15.4 13.34,19.68 13.97,20.32 v13.97,21.59
G11  (via drill 0.38)
  Top 0.406: IC5.15 77.47,29.84 76.83,30.48 76.83,34.92 v75.56,36.2
  Bottom 0.305: 74.3,37.47 JP17.5
  Bottom 0.406: JP17.5 JP28.12 | 74.3,37.47 v75.56,36.2
G12  (via drill 0.38)
  Top 0.406: IC5.1 74.93,31.11 75.56,31.75 v75.56,34.92
  Bottom 0.406: JP28.11 JP17.6 v75.56,34.92
G13  (via drill 0.38)
  Top 0.406: IC5.2 75.25,29.84 v75.88,30.48
  Bottom 0.406: JP28.10 JP17.7 75.25,32.38 75.56,32.07 75.56,30.8 v75.88,30.48
G14  (via drill 0.38)
  Top 0.406: IC5.3 v75.56,28.57
  Bottom 0.406: JP28.9 JP17.8 75.25,29.84 75.56,29.53 v75.56,28.57
G15  (via drill 0.38)
  Top 0.406: IC5.4 v75.56,27.3
  Bottom 0.406: JP28.8 JP7.1 v75.56,27.3
G16  (via drill 0.38)
  Top 0.406: IC5.5 v75.56,26.04
  Bottom 0.406: JP28.7 JP7.2 75.25,24.77 75.56,25.08 v75.56,26.04
G17  (via drill 0.38)
  Top 0.406: IC5.6 75.25,24.77 v75.88,24.13
  Bottom 0.406: JP28.6 JP7.3 75.25,22.23 75.56,22.54 75.56,23.81 v75.88,24.13
G18  (via drill 0.38)
  Top 0.406: IC5.7 74.93,23.5 76.2,22.23 v76.2,21.59
  Bottom 0.406: JP28.5 JP7.4 75.56,19.68 76.2,20.32 v76.2,21.59
GND  (via drill 0.38)  (1 unrouted)
  Top 0.254: U2.11 92.71,35.95 U2.15 | U2.4 92.21,36.2 U2.15 | U2.15 92.46,35.95 U2.13 90.56,35.95 88.77,34.16 C20.2 | U$2.4 35.06,10.66 v35.24,10.48
  Top 0.305: 24.77,49.53 25.4,48.9 25.4,47.35 U$6.15 | U$2.8 29.84,10.16 v27.62,7.94 | U$2.1 33.63,8.59 33.97,8.26 v34.29,8.26
  other vias: 76.83,19.68 15.24,19.68 33.02,43.81 18.41,33.66 29.84,36.83 21.59,40.64 21.59,49.53 92.71,36.2 99.06,39.37 94.61,43.81 87,42.55 87,49.53 15.24,48.58 17.78,53.02 9.53,50.48 3.81,42.23 10.79,7.3 17.14,7.3 17.14,3.49 10.79,3.49 42.55,1.59 41.27,11.11 54.93,3.49 54.93,11.75 54.93,20 39.05,27.3 38.42,35.56 39.69,33.02 20.32,43.81 40.64,47.31 42.86,42.23 39.05,15.56 33.97,17.46 26.99,15.56 36.51,6.03 49.85,8.26 28.57,33.02 28.57,29.21 32.38,30.48 31.75,26.04 28.57,25.4 31.75,23.5 36.2,23.5 38.73,22.86 28.57,20.32 89.22,34.61 85.41,27.62 91.12,28.26 89.22,25.08 95.57,20.64 98.11,21.91 101.28,30.16 99.38,32.07 90.17,37.47 82.55,43.18 82.23,32.07 83.5,37.47
  pour Bottom (isolate 0.254): 0,0 119.38,0 119.38,57.15 0,57.15
  pour Top (isolate 0.254): 0,0 119.38,0 119.38,57.15 0,57.15
GND1
  Top 0.254: U2.9 93.21,33.37 R23.1 96.31,33.66 R18.1
INT  (via drill 0.38)
  Top 0.305: U$6.1 38.73,39.95 38.73,38.1 v39.37,37.47 | v29.84,31.11 34.29,26.67 v37.47,26.67 | v37.47,13.97 SJ1.2
  Bottom 0.305: v39.37,37.47 38.1,38.73 34.29,38.73 29.84,34.29 v29.84,31.11 | v37.47,26.67 v37.47,13.97
INT2
  Top 0.305: U$3.P7 27.39,10.56 28.57,11.75 33.34,11.75 33.63,11.45 U$2.5 34.66,11.16 34.92,11.43 SJ1.1
INT3
  Top 0.254: SJ1.3 38.35,9.78 37.47,8.89 37.47,6.35 38.1,5.71 38.52,5.71 R9.1
  Top 0.305: R9.1 38.73,2.71 T1.C
N$1  (via drill 0.38)
  Top 0.305: IC7.7 9.53,37.47 9.21,37.15 9.21,19.37 9.84,18.73 14.29,18.73 17.14,15.88 17.14,11.43 v17.78,10.79
  Bottom 0.305: v17.78,10.79 Q1.2
N$2  (via drill 0.38)
  Top 0.305: IC7.6 9.21,38.73 8.57,38.1 8.57,19.05 9.53,18.1 13.65,18.1 15.88,15.88 15.88,13.34 v13.34,10.79
  Bottom 0.305: v13.34,10.79 Q1.5
N$3
  Top 0.305: U$6.16 24.77,46.85 24.77,48.05 Y2.3
N$4
  Top 0.305: IC9.4 29.66,13.3 C13.1
N$5
  Top 0.305: C11.2 44.03,6.67 44.45,6.67 45.62,5.5 R5.1 47.62,3.6 MIC.1
N$6  (via drill 0.38)
  Top 0.305: IC8.7 71.75,37.47 71.44,37.15 71.44,19.37 72.07,18.73 76.52,18.73 79.38,15.88 79.38,11.43 v80.01,10.79
  Bottom 0.305: v80.01,10.79 Q5.2
N$7  (via drill 0.38)
  Top 0.305: IC7.5 8.89,40.01 7.94,39.05 7.94,18.73 9.21,17.46 13.02,17.46 14.61,15.88 v14.61,13.65
  Bottom 0.305: v14.61,13.65 16.83,13.65 17.78,14.61 17.78,15.56 17.46,15.88 Q2.2 16.51,15.88
N$8  (via drill 0.38)
  Top 0.305: IC7.4 8.57,41.27 7.3,40.01 7.3,18.41 8.89,16.83 12.38,16.83 v13.34,15.88
  Bottom 0.305: v13.34,15.88 Q2.5
N$9  (via drill 0.38)
  Top 0.305: IC7.3 11.11,42.55 v14.61,39.05
  Bottom 0.305: v14.61,39.05 16.51,39.05 17.46,40.01 17.46,40.96 17.14,41.27 Q3.2
N$10  (via drill 0.38)
  Top 0.305: IC8.6 71.44,38.73 70.8,38.1 70.8,19.05 71.75,18.1 75.88,18.1 78.11,15.88 78.11,13.34 v75.56,10.79
  Bottom 0.305: v75.56,10.79 Q5.5 77.47,10.79
N$11
  Top 0.254: U1.5 86.05,44.77 85.72,45.09 R15.2
N$12  (via drill 0.38)
  Top 0.305: v13.97,41.27 11.43,43.81 IC7.2
  Bottom 0.305: v13.97,41.27 Q3.5
N$13
  Top 0.305: T1.B 41.27,3.66 R8.1 C11.1
N$14  (via drill 0.38)
  Top 0.305: v13.65,44.13 12.7,45.09 IC7.1
  Bottom 0.305: Q4.2 17.14,46.35 17.46,46.04 17.46,45.09 16.51,44.13 v13.65,44.13
N$15
  Top 0.305: IC8.9 79.38,36.2 C_OUT.1
N$16  (via drill 0.38)
  Top 0.305: v13.65,46.04 13.65,45.4 15.24,43.81 IC7.15
  Bottom 0.305: Q4.5 13.97,46.35 v13.65,46.04
N$17
  Top 0.305: Y1.2 19.95,14.97 22.77,12.16 U$3.P1
N$18
  Top 0.305: U$6.17 24.13,46.35 23.07,46.35 Y2.1
N$19
  Top 0.305: U$3.P2 20.55,10.56 19.95,11.16 Y1.1
N$20
  Top 0.305: U$3.P3 21.82,9.76 21.59,9.53 21.59,5.97 BAT1.PWR@1
N$21  (via drill 0.38)
  Top 0.305: IC8.5 71.12,40.01 70.17,39.05 70.17,18.73 71.44,17.46 75.25,17.46 76.83,15.88 v76.83,13.65
  Bottom 0.305: v76.83,13.65 79.06,13.65 80.01,14.61 80.01,15.56 79.69,15.88 Q6.2
N$22
  Top 0.305: R6.2 35.56,45.36 U$6.4
N$23
  Top 0.305: R2.2 36.09,44.45 35.78,44.45 U$6.3
N$24
  Top 0.305: C19.1 33.97,46.04 U$6.6
N$25
  Top 0.305: IC6.9 101.6,24.77 100.97,25.4 B_OUT.1
N$26  (via drill 0.9 pad 1.78)
  other vias: 67.94,1.91
N$27  (via drill 0.38)
  Top 0.305: IC8.4 70.8,41.27 69.53,40.01 69.53,18.41 71.12,16.83 74.61,16.83 v75.56,15.88
  Bottom 0.305: v75.56,15.88 Q6.5
N$28  (via drill 0.38)
  Top 0.305: IC8.3 73.03,42.55 v76.83,38.73
  Bottom 0.305: v76.83,38.73 78.42,38.73 79.69,40.01 79.69,40.96 79.38,41.27 Q7.2
N$29  (via drill 0.38)
  Top 0.305: IC8.2 73.66,43.81 v76.2,41.27
  Bottom 0.305: v76.2,41.27 Q7.5 77.47,41.27
N$30  (via drill 0.9 pad 1.78)
  other vias: 70.48,1.91
N$31  (via drill 0.38)
  Top 0.305: IC8.1 74.93,45.09 v75.88,44.13
  Bottom 0.305: v75.88,44.13 78.74,44.13 79.69,45.09 79.69,46.04 79.38,46.35 Q8.2
N$32  (via drill 0.38)
  Top 0.305: v75.88,46.04 75.88,45.4 77.47,43.81 IC8.15
  Bottom 0.305: Q8.5 76.2,46.35 v75.88,46.04
N$33
  Top 0.406: LED3.C R13.2
N$34
  Top 0.406: LED4.C R14.2
N$35
  Top 0.254: U2.3 92.71,39.37
  Top 0.61: 92.71,39.37 92.71,40.41 L1.P$1
N$36
  Top 0.254: C21.1 95.89,37.47 95.68,37.67 U2.1
N$37
  Top 0.305: G_OUT.1 78.36,20.7 IC5.9
N$38  (via drill 0.9 pad 1.78)
  other vias: 73.03,1.91
N$39  (via drill 0.9 pad 1.78)
  other vias: 75.56,1.91
N$40
  Top 0.305: IC4.9 101.6,45.09 100.97,45.72 R_OUT.1
N$42  (via drill 0.9 pad 1.78)
  other vias: 67.94,4.45
N$43  (via drill 0.9 pad 1.78)
  other vias: 70.48,4.45
N$44  (via drill 0.9 pad 1.78)
  other vias: 73.03,4.45
N$45  (via drill 0.9 pad 1.78)
  other vias: 75.56,4.45
N$47  (via drill 0.9 pad 1.78)
  other vias: 78.11,1.91
N$48  (via drill 0.9 pad 1.78)
  other vias: 80.64,1.91
N$49  (via drill 0.9 pad 1.78)
  other vias: 83.19,1.91
N$51  (via drill 0.9 pad 1.78)
  other vias: 85.72,1.91
N$52  (via drill 0.9 pad 1.78)
  other vias: 78.11,4.45
N$53  (via drill 0.9 pad 1.78)
  other vias: 80.64,4.45
N$54  (via drill 0.9 pad 1.78)
  other vias: 83.19,4.45
N$55  (via drill 0.9 pad 1.78)
  other vias: 85.72,4.45
N$56  (via drill 0.9 pad 1.78)
  other vias: 88.27,1.91
N$59  (via drill 0.9 pad 1.78)
  other vias: 90.81,1.91
N$60  (via drill 0.9 pad 1.78)
  other vias: 93.34,1.91
N$61  (via drill 0.9 pad 1.78)
  other vias: 95.89,1.91
N$62  (via drill 0.9 pad 1.78)
  other vias: 88.27,4.45
N$63  (via drill 0.9 pad 1.78)
  other vias: 90.81,4.45
N$64  (via drill 0.9 pad 1.78)
  other vias: 93.34,4.45
N$65  (via drill 0.9 pad 1.78)
  other vias: 95.89,4.45
N$67  (via drill 0.9 pad 1.78)
  other vias: 98.42,1.91
N$68  (via drill 0.9 pad 1.78)
  other vias: 100.97,1.91
N$69  (via drill 0.9 pad 1.78)
  other vias: 103.5,1.91
N$71  (via drill 0.9 pad 1.78)
  other vias: 106.05,1.91
N$72  (via drill 0.9 pad 1.78)
  other vias: 98.42,4.45
N$75  (via drill 0.9 pad 1.78)
  other vias: 100.97,4.45
N$76  (via drill 0.9 pad 1.78)
  other vias: 103.5,4.45
N$77  (via drill 0.9 pad 1.78)
  other vias: 106.05,4.45
N$78  (via drill 0.9 pad 1.78)
  other vias: 67.94,6.99
N$79  (via drill 0.9 pad 1.78)
  other vias: 70.48,6.99
N$80  (via drill 0.9 pad 1.78)
  other vias: 73.03,6.99
N$81  (via drill 0.9 pad 1.78)
  other vias: 75.56,6.99
N$83  (via drill 0.9 pad 1.78)
  other vias: 78.11,6.99
N$84  (via drill 0.9 pad 1.78)
  other vias: 80.64,6.99
N$87  (via drill 0.9 pad 1.78)
  other vias: 83.19,6.99
N$89  (via drill 0.9 pad 1.78)
  other vias: 85.72,6.99
N$90  (via drill 0.9 pad 1.78)
  other vias: 88.27,6.99
N$91  (via drill 0.9 pad 1.78)
  other vias: 90.81,6.99
N$92  (via drill 0.9 pad 1.78)
  other vias: 93.34,6.99
N$93  (via drill 0.9 pad 1.78)
  other vias: 95.89,6.99
N$94  (via drill 0.9 pad 1.78)
  other vias: 98.42,6.99
N$95  (via drill 0.9 pad 1.78)
  other vias: 100.97,6.99
N$96  (via drill 0.9 pad 1.78)
  other vias: 103.5,6.99
N$97  (via drill 0.9 pad 1.78)
  other vias: 106.05,6.99
N$98  (via drill 0.9 pad 1.78)
  other vias: 108.58,1.91
N$99  (via drill 0.9 pad 1.78)
  other vias: 111.12,1.91
N$102  (via drill 0.9 pad 1.78)
  other vias: 113.67,1.91
N$103  (via drill 0.9 pad 1.78)
  other vias: 116.2,1.91
N$105  (via drill 0.9 pad 1.78)
  other vias: 108.58,4.45
N$107  (via drill 0.9 pad 1.78)
  other vias: 111.12,4.45
N$108  (via drill 0.9 pad 1.78)
  other vias: 113.67,4.45
N$109  (via drill 0.9 pad 1.78)
  other vias: 116.2,4.45
N$110  (via drill 0.9 pad 1.78)
  other vias: 108.58,6.99
N$111  (via drill 0.9 pad 1.78)
  other vias: 111.12,6.99
N$112  (via drill 0.9 pad 1.78)
  other vias: 113.67,6.99
N$113  (via drill 0.9 pad 1.78)
  other vias: 116.2,6.99
PS
  Top 0.254: U2.8 R19.1
R1  (via drill 0.38)
  Top 0.406: IC1.15 41.91,37.47 42.55,36.83 42.55,32.07 v43.5,31.11
  Bottom 0.406: JP26.9 JP6.8 44.77,29.84 v43.5,31.11
R2  (via drill 0.38)
  Top 0.406: IC1.1 44.45,36.2 43.81,35.56 v43.81,32.38
  Bottom 0.406: JP26.10 JP6.7 v43.81,32.38
R3  (via drill 0.38)
  Top 0.406: IC1.2 44.13,37.47 v43.5,36.83
  Bottom 0.406: JP26.11 JP6.6 44.13,34.92 43.81,35.24 43.81,36.51 v43.5,36.83
R4  (via drill 0.38)
  Top 0.406: IC1.3 v43.81,38.73
  Bottom 0.406: JP26.12 JP6.5 44.13,37.47 43.81,37.78 v43.81,38.73
R5  (via drill 0.38)
  Top 0.406: v43.81,40.01 IC1.4
  Bottom 0.406: JP26.13 JP6.4 v43.81,40.01
R6  (via drill 0.38)
  Top 0.406: IC1.5 v43.81,41.27
  Bottom 0.406: JP26.14 JP6.3 44.13,42.55 43.81,42.23 v43.81,41.27
R7  (via drill 0.38)
  Top 0.406: IC1.6 44.13,42.55 v43.5,43.18
  Bottom 0.406: JP26.15 JP6.2 44.13,45.09 43.81,44.77 43.81,43.5 v43.5,43.18
R8  (via drill 0.38)
  Top 0.406: IC1.7 44.45,43.81 43.81,44.45 v43.81,47.62
  Bottom 0.406: JP26.16 JP6.1 v43.81,47.62
R11  (via drill 0.38)
  Top 0.406: IC4.15 104.14,37.47 104.78,36.83 104.78,31.11 v106.05,29.84
  Bottom 0.406: JP29.9 JP9.8 v106.05,29.84
R12  (via drill 0.38)
  Top 0.406: IC4.1 106.68,36.2 106.05,35.56 v106.05,32.38
  Bottom 0.406: JP29.10 JP9.7 v106.05,32.38
R13  (via drill 0.38)
  Top 0.406: IC4.2 106.36,37.47 v105.73,36.83
  Bottom 0.406: JP29.11 JP9.6 106.36,34.92 106.05,35.24 106.05,36.51 v105.73,36.83
R14  (via drill 0.38)
  Top 0.406: IC4.3 v106.05,38.73
  Bottom 0.406: JP29.12 JP9.5 106.36,37.47 106.05,37.78 v106.05,38.73
R15  (via drill 0.38)
  Top 0.406: IC4.4 v106.05,40.01
  Bottom 0.406: JP29.13 JP9.4 v106.05,40.01
R16  (via drill 0.38)
  Top 0.406: IC4.5 v106.05,41.27
  Bottom 0.406: JP29.14 JP9.3 106.36,42.55 106.05,42.23 v106.05,41.27
R17  (via drill 0.38)
  Top 0.406: IC4.6 106.36,42.55 v105.73,43.18
  Bottom 0.406: JP29.15 JP9.2 106.36,45.09 106.05,44.77 106.05,43.5 v105.73,43.18
R18  (via drill 0.38)
  Top 0.406: IC4.7 106.68,43.81 106.05,44.45 v106.05,47.62
  Bottom 0.406: JP29.16 JP9.1 v106.05,47.62
RCLK  (via drill 0.38)  (1 unrouted)
  Top 0.305: IC7.12 v18.41,40.01 18.41,38.73 20.32,36.83 23.63,36.83 U$6.27 25.86,39.05 26.99,39.05 28.89,40.96 v28.89,41.59 | IC2.12 v17.14,26.04 17.78,26.04 18.41,26.67 REG1.2 | IC5.12 v79.38,26.04 80.01,26.04 80.64,26.67 REG2.2 | v80.64,40.01 IC8.12 | IC1.12 v40.01,41.27 | v42.23,20.95 IC3.12 | IC4.12 v102.23,41.27 | v104.46,20.95 IC6.12 101.6,20.95 97.16,16.51 v86.36,16.51
  Bottom 0.305: v18.41,40.01 18.41,38.42 15.88,35.88 15.88,27.3 v17.14,26.04 | v79.38,26.04 78.11,27.3 78.11,35.88 80.64,38.42 v80.64,40.01 | v42.23,20.95 40.96,22.23 40.96,24.13 41.27,24.45 41.27,40.01 v40.01,41.27 39.37,40.64 29.84,40.64 v28.89,41.59 | v102.23,41.27 103.5,40.01 103.5,24.45 103.19,24.13 103.19,22.23 v104.46,20.95 | v86.36,16.51 86.36,17.78 84.45,19.68 84.45,24.13 REG2.2
REF
  Top 0.305: U$6.42 35.78,38.1 36.2,38.1 37.15,37.15 C22.1
REN  (via drill 0.38)  (1 unrouted)
  Top 0.305: IC7.13 v19.37,41.27 19.37,38.73 20.64,37.47 23.14,37.47 U$6.26 25.36,39.69 26.35,39.69 v27.94,41.27 | IC2.13 v17.14,27.3 17.78,27.3 REG1.1 | IC5.13 v79.38,27.3 80.01,27.3 REG2.1 | v81.6,41.27 IC8.13 | IC1.13 v40.01,40.01 | v42.23,19.68 IC3.13 | IC4.13 v102.23,40.01 | v104.46,19.68 IC6.13 101.6,19.68 97.16,15.24 v87.63,15.24
  Bottom 0.305: v19.37,41.27 19.37,38.1 16.51,35.24 16.51,27.94 v17.14,27.3 | v79.38,27.3 78.74,27.94 78.74,35.24 81.6,38.1 v81.6,41.27 | v42.23,19.68 40.32,21.59 40.32,24.45 40.64,24.77 40.64,39.37 v40.01,40.01 29.21,40.01 v27.94,41.27 | v102.23,40.01 102.87,39.37 102.87,24.77 102.55,24.45 102.55,21.59 v104.46,19.68 | v87.63,15.24 87.63,17.78 85.09,20.32 85.09,26.04 REG2.1
RST
  Top 0.305: U$6.13 26.67,48.34 26.67,50.8 27.3,51.44 27.3,53.34 J1.5 23.71,54.61 R7.2 21.8,54.83 S1.P$2
RX
  Top 0.305: SERIAL.1 6.99,46.35 10.79,50.16 16.93,50.16 U$6.20
SBLUE  (via drill 0.38)
  Top 0.305: IC3.14 v42.23,18.41 | v39.69,26.04 39.37,25.72 33.97,25.72 28.57,31.11 v28.57,31.75 | U$6.12 28.57,47.57 v28.57,46.35
  Bottom 0.305: v42.23,18.41 39.69,20.95 v39.69,26.04 | v28.57,46.35 28.57,43.18 26.67,41.27 26.67,33.02 27.94,31.75 v28.57,31.75
SBLUE1  (via drill 0.38)  (1 unrouted)
  Top 0.305: IC6.14 v104.46,18.41 | v93.34,24.13 92.08,24.13 DAT2.1 | DAT1.1 26.67,29.21 31.11,24.77 IC3.9
  Bottom 0.305: v104.46,18.41 99.06,18.41 v93.34,24.13
SCL  (via drill 0.38)
  Top 0.254: I2C.2 25.4,6.03 24.77,6.67 24.77,8.57 25.95,9.76 U$3.P6 27.54,9.76
  Top 0.305: 27.54,9.76 28.94,11.16 U$2.6 32.34,11.16 32.7,10.79 32.7,7.94 33.34,7.3 | 33.44,7.2 33.66,6.99 | U$6.18 26.17,43.18 v27.3,43.18 | v24.77,16.83 24.77,13.34 25.4,12.7 v25.4,11.11
  Top 0.406: 33.66,6.99 33.66,7.2 R20.2 33.34,7.3
  Bottom 0.305: v27.3,43.18 26.04,41.91 26.04,32.07 27.3,30.8 27.3,20.64 24.77,18.1 v24.77,16.83 | v25.4,11.11 25.4,12.7 24.77,13.34 23.5,13.34 22.86,12.7 22.86,7.94 25.4,5.4 I2C.2
SCLK  (via drill 0.38)  (1 unrouted)
  Top 0.305: IC7.11 v17.46,38.73 20,36.2 24.13,36.2 U$6.28 26.35,38.42 27.3,38.42 29.84,40.96 v29.84,41.91 | IC2.11 v17.14,24.77 17.78,24.77 18.41,24.13 REG1.3 | IC5.11 v79.38,24.77 80.01,24.77 80.64,24.13 REG2.3 | v79.69,38.73 IC8.11 | IC1.11 v40.01,42.55 | v42.23,22.23 IC3.11 | IC4.11 v102.23,42.55 | v104.46,22.23 IC6.11 101.6,22.23 97.16,17.78 v85.09,17.78
  Bottom 0.305: v17.46,38.73 15.24,36.51 15.24,26.67 v17.14,24.77 | v79.38,24.77 77.47,26.67 77.47,36.51 v79.69,38.73 | v42.23,22.23 41.59,22.86 41.59,23.81 41.91,24.13 41.91,40.64 v40.01,42.55 38.73,41.27 30.48,41.27 v29.84,41.91 | v102.23,42.55 104.14,40.64 104.14,24.13 103.82,23.81 103.82,22.86 v104.46,22.23 | v85.09,17.78 84.45,17.78 83.82,18.41 83.82,22.23 REG2.3
SCLR  (via drill 0.38)  (1 unrouted)
  Top 0.305: v13.34,38.73 14.61,37.47 IC7.10 17.78,37.47 19.68,35.56 24.63,35.56 U$6.29 26.85,37.78 27.62,37.78 30.8,40.96 v30.8,42.23 | IC2.10 v17.14,23.5 17.78,23.5 REG1.4 | IC5.10 v79.38,23.5 80.01,23.5 REG2.4 84.45,19.05 97.16,19.05 101.6,23.5 IC6.10 v104.78,23.5 | v75.56,38.73 76.83,37.47 IC8.10 78.74,37.47 | IC1.10 v40.01,43.81 | v42.55,23.5 IC3.10 | IC4.10 v102.23,43.81
  Bottom 0.305: v13.34,38.73 14.61,37.47 14.61,26.04 v17.14,23.5 | v79.38,23.5 76.83,26.04 76.83,37.47 v75.56,38.73 | v42.55,23.5 42.55,41.27 v40.01,43.81 38.1,41.91 31.11,41.91 v30.8,42.23 | v102.23,43.81 104.78,41.27 v104.78,23.5
SCOM
  Top 0.305: U$6.25 22.64,38.1 20.95,38.1 20.32,38.73 20.32,41.59 19.37,42.55 IC7.14
SCOM1  (via drill 0.38)  (1 unrouted)
  Top 0.305: DAT2.3 85.09,24.13 84.45,24.77 84.45,38.1 82.87,39.69 82.87,41.59 81.92,42.55 IC8.14 | IC7.9 17.46,36.2 v19.05,34.61
  Bottom 0.305: v19.05,34.61 21.27,32.38 21.27,25.08 22.23,24.13 DAT1.3
SDA  (via drill 0.38)
  Top 0.254: I2C.1 27.94,4.45 25.4,6.99 25.4,8.26 26.11,8.96 U$3.P5 27.69,8.96
  Top 0.305: 27.69,8.96 29.39,10.66 U$2.7 31.89,10.66 32.07,10.48 32.07,7.94 31.75,7.62 31.75,7.52 R3.2 31.33,7.2 | U$6.19 25.4,42.82 v25.4,42.55 | v23.5,17.78 23.5,12.7 v24.13,12.06
  Bottom 0.305: v25.4,42.55 25.4,31.75 26.67,30.48 26.67,20.95 v23.5,17.78 | v24.13,12.06 24.13,8.26 27.94,4.45 I2C.1
SGREEN
  Top 0.305: IC2.14 17.14,28.57 17.78,29.21 17.78,31.75 20.95,34.92 26.25,34.92 U$6.31
SGREEN1  (1 unrouted)
  Top 0.305: DAT2.4 85.72,21.59 83.82,23.5 83.82,29.84 82.55,31.11 81.28,31.11 80.01,29.84 80.01,29.21 79.38,28.57 IC5.14 | IC2.9 16.14,20.7 17.14,19.68 22.86,19.68 DAT1.4
SPKR
  Top 0.305: SPEAKER.1 49.53,26.04 47.31,28.26 36.2,28.26 33.02,31.43 32.07,31.43 29.21,34.29 29.21,34.92 28.57,35.56 28.02,35.56 U$6.32
SRED  (via drill 0.38)
  Top 0.305: IC1.14 v39.69,38.73 | v29.84,38.73 28.26,37.15 27.34,37.15 U$6.30
  Bottom 0.305: v39.69,38.73 39.05,39.37 30.48,39.37 v29.84,38.73
SRED1  (via drill 0.38)  (1 unrouted)
  Top 0.305: IC4.14 102.23,38.73 v101.6,38.1 | v27.62,45.09 v30.48,45.09 | v40.01,45.09 IC1.9 41.27,45.09
  Bottom 0.305: v101.6,38.1 101.6,32.38 95.89,26.67 DAT2.2 | DAT1.2 22.86,26.67 22.23,27.3 22.23,38.1 24.77,40.64 24.77,41.59 24.45,41.91 24.45,43.5 26.04,45.09 v27.62,45.09 | v30.48,45.09 30.48,44.45 32.38,42.55 37.15,42.55 39.69,45.09 v40.01,45.09
TX
  Top 0.305: U$6.21 16.43,49.53 11.43,49.53 7.62,45.72 7.62,44.45 6.99,43.81 SERIAL.2
UVLO  (via drill 0.38)
  Top 0.254: U2.7 92.21,33.37 C18.2
  Top 0.305: R22.1 96.31,31.96 R23.2 v94.61,29.21 | v90.81,33.34 C18.2
  Bottom 0.305: v94.61,29.21 94.61,29.53 v90.81,33.34
VBAT
  Top 0.254: U2.5 91.71,38.47 91.44,38.73 91.44,39.37
  Top 0.305: R22.2 96.52,29.21 95.57,28.26 93.66,28.26 92.71,29.21 R19.2 C18.1 R16.2 88.8,30.27 87.63,31.43 86.36,31.43 85.09,32.7 85.09,35.88 86.04,36.83 87.63,36.83 C20.1
  Top 0.406: LED4.A 82.77,48.9 82.55,48.9
  Top 0.61: 91.44,39.37 91.44,40.41 L1.P$2 90.58,41.05 88.27,38.73 87.63,38.73 | U$4.P 68.69,51.32 69.22,50.8 80.64,50.8 82.55,48.9 83.82,47.62 83.82,40.01 85.09,38.73 87.63,38.73 | C20.1 87.63,38.73
VBUS  (1 unrouted)
  Top 0.254: U1.4 87.94,44.77 88.27,45.09 C23.1
  Top 0.305: U$6.2 34.69,42.23 33.34,42.23 32.07,43.5 32.07,45.26 U$6.7
  Top 0.406: U$6.2 36.27,43.81 37.47,43.81 38.73,45.09 38.73,48.26 39.98,49.5 U$1.P1 56.8,49.5 57.15,49.85 57.15,53.98 56.52,54.61 POW1.4 | C23.1 89.95,46.14 91.44,47.62 91.44,49.31 LED3.A 92.93,53.56 95.89,56.52 111.76,56.52 POW2.4
VCC  (via drill 0.38)  (1 unrouted)
  Top 0.254: U2.2 93.21,38.6 93.98,39.37 | C8.1 15.56,47.62 15.88,47.94 v16.68,47.94 | v39.37,34.51 C1.1 | U$6.34 31.81,33.02 v32.38,33.02
  Top 0.305: IC1.16 41.27,35.94 C1.1 41.27,34.29 | IC2.16 15.88,31.38 C3.1 16.09,33.02 v17.46,33.02 | IC3.16 41.27,15.62 C2.1 40.22,14.19 40.01,13.97 v40.01,7.2 | C6.1 78.11,31.38 IC5.16 79.38,31.11 v80.01,31.75 | C5.1 103.5,35.94 IC4.16 | C4.1 103.5,15.62 IC6.16 | IC8.16 78.11,45.09 C7.1 78.64,46.77 v80.64,44.77 | IC9.1 33.34,14.92 33.02,14.61 31.75,14.61 31.43,14.92 IC9.3 31.43,17.46 v31.11,17.78 | U$6.14 26.04,47.84 26.04,49.53 v25.72,49.85 23.5,52.07 R7.1 | R20.1 32.38,5.5 v32.38,4.45 | v39.37,34.51 39.37,35.88 38.1,37.15 38.1,38.04 U$6.44 34.87,41.27 33.02,41.27 31.11,43.18 28.57,43.18 26.67,41.27 v23.81,41.27 23.81,40.4 U$6.24 | IC7.16 v18.41,45.09 | R10.2 36.62,31.75 v36.51,31.75
  Top 0.406: IC10.1 53.83,3.32 53.34,3.81 v53.34,6.99 53.34,8.89 53.83,9.38 IC11.1 53.83,11.58 53.34,12.06 53.34,17.14 53.83,17.63 IC12.1 | R3.1 R20.1 | R5.2 44.66,8.26 42.55,8.26 41.49,7.2 R8.2 v40.01,7.2 R9.2 | U$3.P8 26.77,12.61 v26.67,12.7 | IC4.16 101.6,36.2 100.97,35.56 v100.33,35.56 R17.2 | IC6.16 100.33,15.88 v97.79,13.34
  Top 0.61: 93.98,39.37 95.89,39.37 v96.52,40.01 C16.1 | POW2.2 108.58,53.98 105.41,50.8 v102.23,50.8
  Bottom 0.254: Q3.1 17.8,41.92 18.41,42.55 20,42.55 | 20.64,42.55 22.54,42.55 v23.81,41.27 | v32.38,33.02 33.87,34.51 v39.37,34.51
  Bottom 0.305: Q5.4 77.32,10.16 77.79,10.16 78.11,10.48 78.11,11.11 78.42,11.43 78.89,11.43 Q5.1 78.91,12.55 80.49,14.13 | Q6.4 77.32,15.24 77.79,15.24 78.11,15.56 78.11,16.19 78.42,16.51 78.89,16.51 Q6.1 80,16.52 | Q7.4 77.32,40.64 77.79,40.64 78.11,40.96 78.11,41.59 78.42,41.91 78.89,41.91 Q7.1 | Q8.4 77.32,45.72 77.79,45.72 78.11,46.04 78.11,46.67 78.42,46.99 78.89,46.99 Q8.1 79.68,47.01 80.64,46.04 v80.64,44.77 | Q4.4 15.09,45.72 15.56,45.72 15.88,46.04 15.88,46.67 16.19,46.99 16.66,46.99 Q4.1 | Q3.4 15.09,40.64 15.56,40.64 15.88,40.96 15.88,41.59 16.19,41.91 16.66,41.91 Q3.1 16.68,43.34 v18.41,45.09 18.41,46.04 17.45,47.01 Q4.1 | Q1.4 15.09,10.16 15.56,10.16 15.88,10.48 15.88,11.11 16.19,11.43 16.66,11.43 Q1.1 16.68,12.55 18.41,14.29 | Q2.4 15.09,15.24 15.56,15.24 15.88,15.56 15.88,16.19 16.19,16.51 16.66,16.51 Q2.1 | 80,16.52 80.64,15.88 80.64,14.29 80.49,14.13 | Q2.1 17.77,16.52 18.41,15.88 18.41,14.29 | Q7.1 78.91,43.34 79.22,43.34 v80.64,44.77 | J1.2 29.84,50.8 26.67,50.8 v25.72,49.85 22.23,53.34 19.68,53.34 16.68,50.33 v16.68,47.94 Q4.1 | v31.11,17.78 31.11,17.14 v26.67,12.7 | 25.08,14.29 18.41,14.29 | Q2.1 16.68,21.44 18.1,22.86 18.1,32.38 v17.46,33.02 17.14,33.34 17.14,34.92 20.32,38.1 20.32,42.23 | 20.32,42.23 20,42.55 20.64,42.55 20.32,42.23 | v36.51,31.75 35.24,33.02 v32.38,33.02 | 80.49,14.13 80.64,13.97 | 80,16.52 80.33,16.86 80.33,31.43 v80.01,31.75 82.55,34.29 82.55,41.59 81.92,42.23 80.33,42.23 80.01,41.91 Q7.1 | v96.52,40.01 93.34,40.01 88.58,44.77 v80.64,44.77
  Bottom 0.406: v53.34,6.99 53.12,7.2 v40.01,7.2 37.25,4.45 v32.38,4.45 29.84,4.45 26.67,7.62 v26.67,12.7 25.08,14.29 | v100.33,35.56 100.33,36.2 v96.52,40.01 | v97.79,13.34 81.28,13.34 80.64,13.97
  Bottom 0.61: POW1.2 46.35,52.7 45.72,52.07 J1.2 | v102.23,50.8 100.97,50.8 96.52,46.35 v96.52,40.01

### Text on the board
tPlace: PWR | PWR | + | + | RX | TX | LITE | SR | SD | SR | SD | SPKR | CA | MIC | INT | I2C | MIC | SDA | SCL